# EAGLE board CTT-20190123 (EAGLE 6.6.0), part 1 of 3
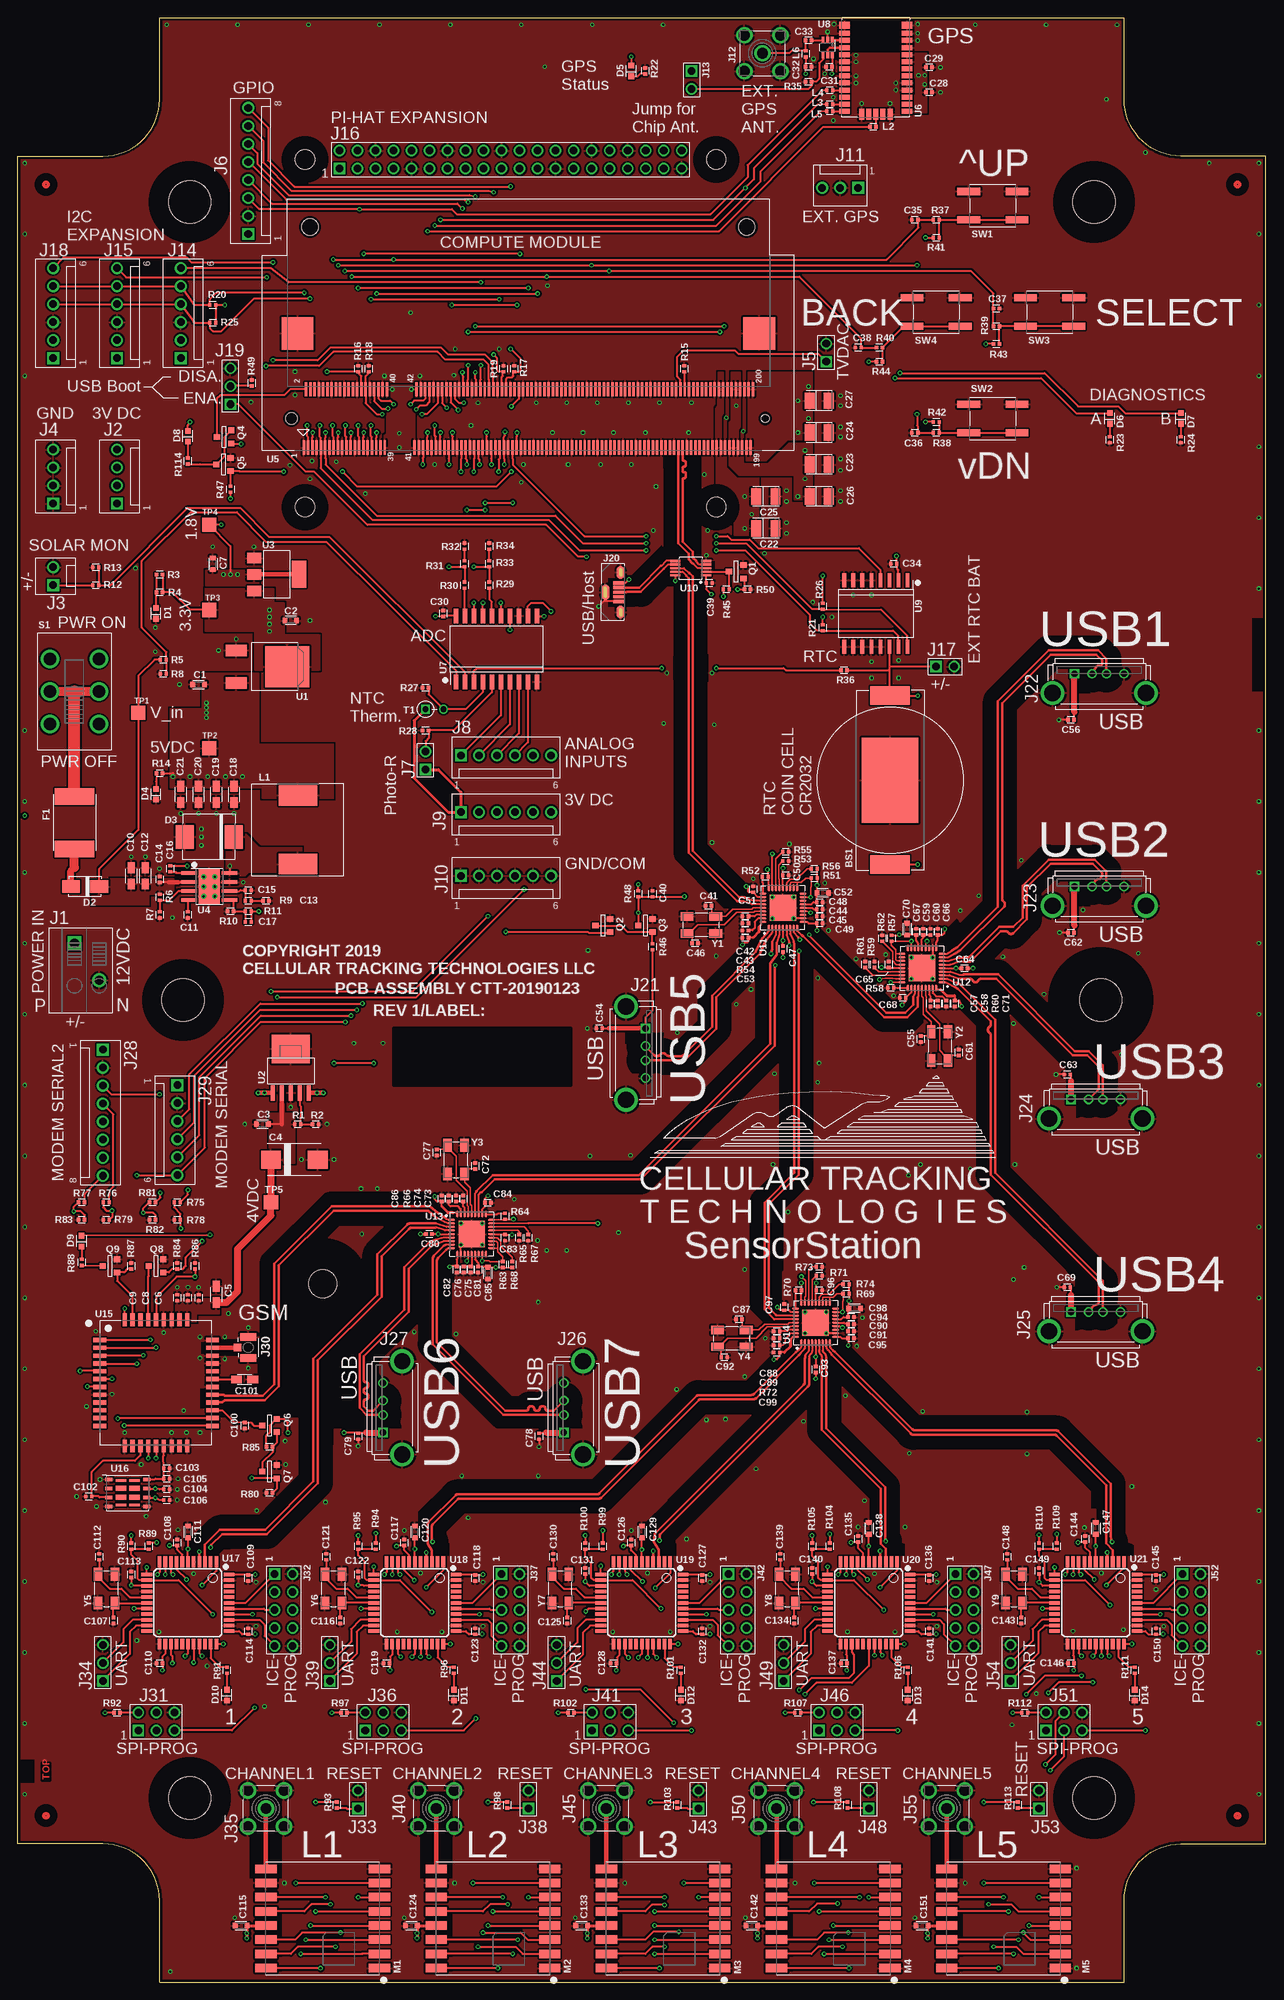
[diagram p12: board, top side]
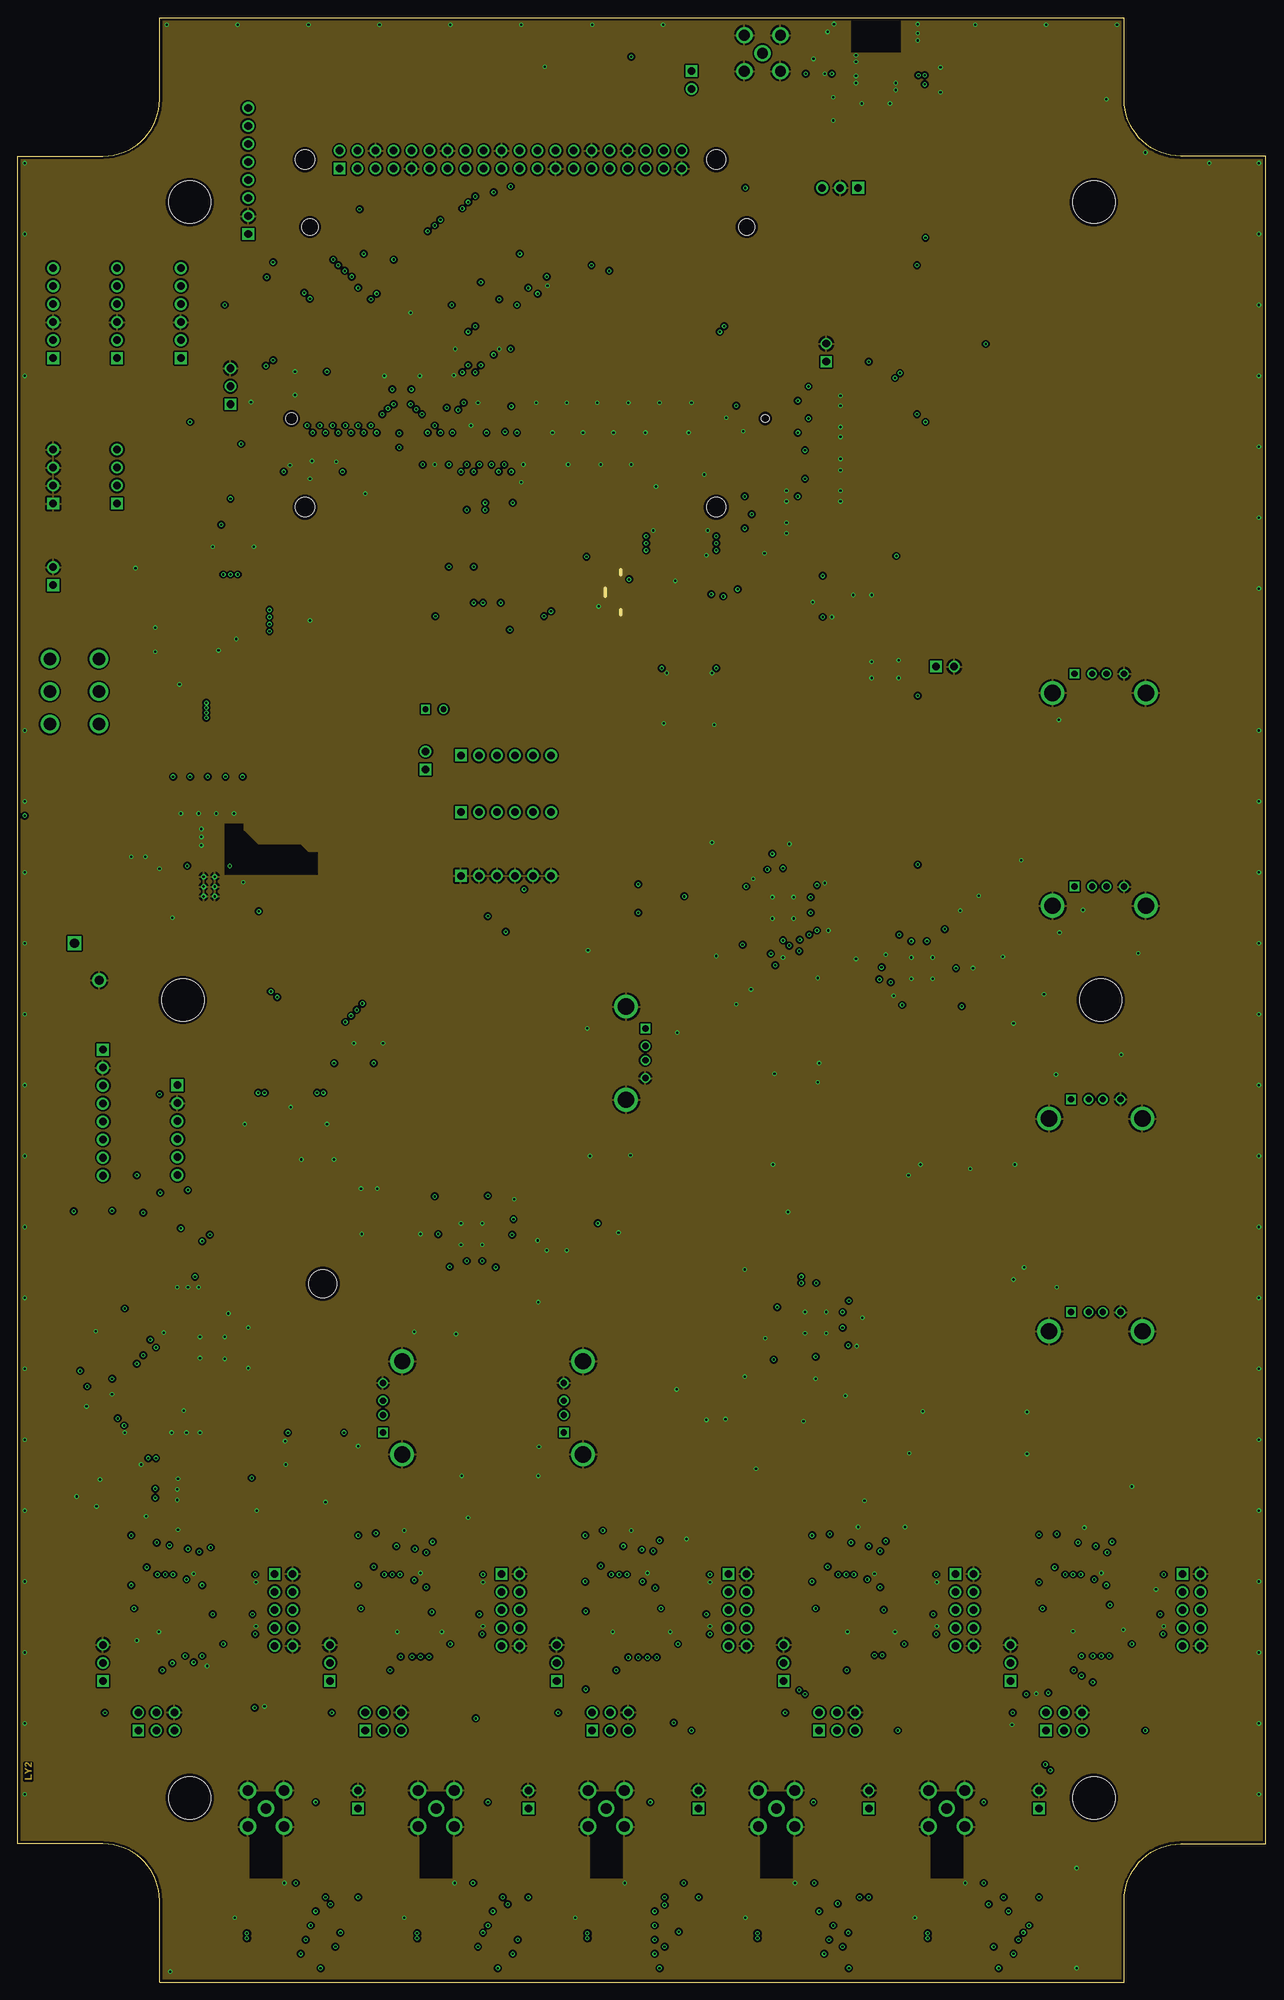
[diagram p13: board, inner layer Route2]
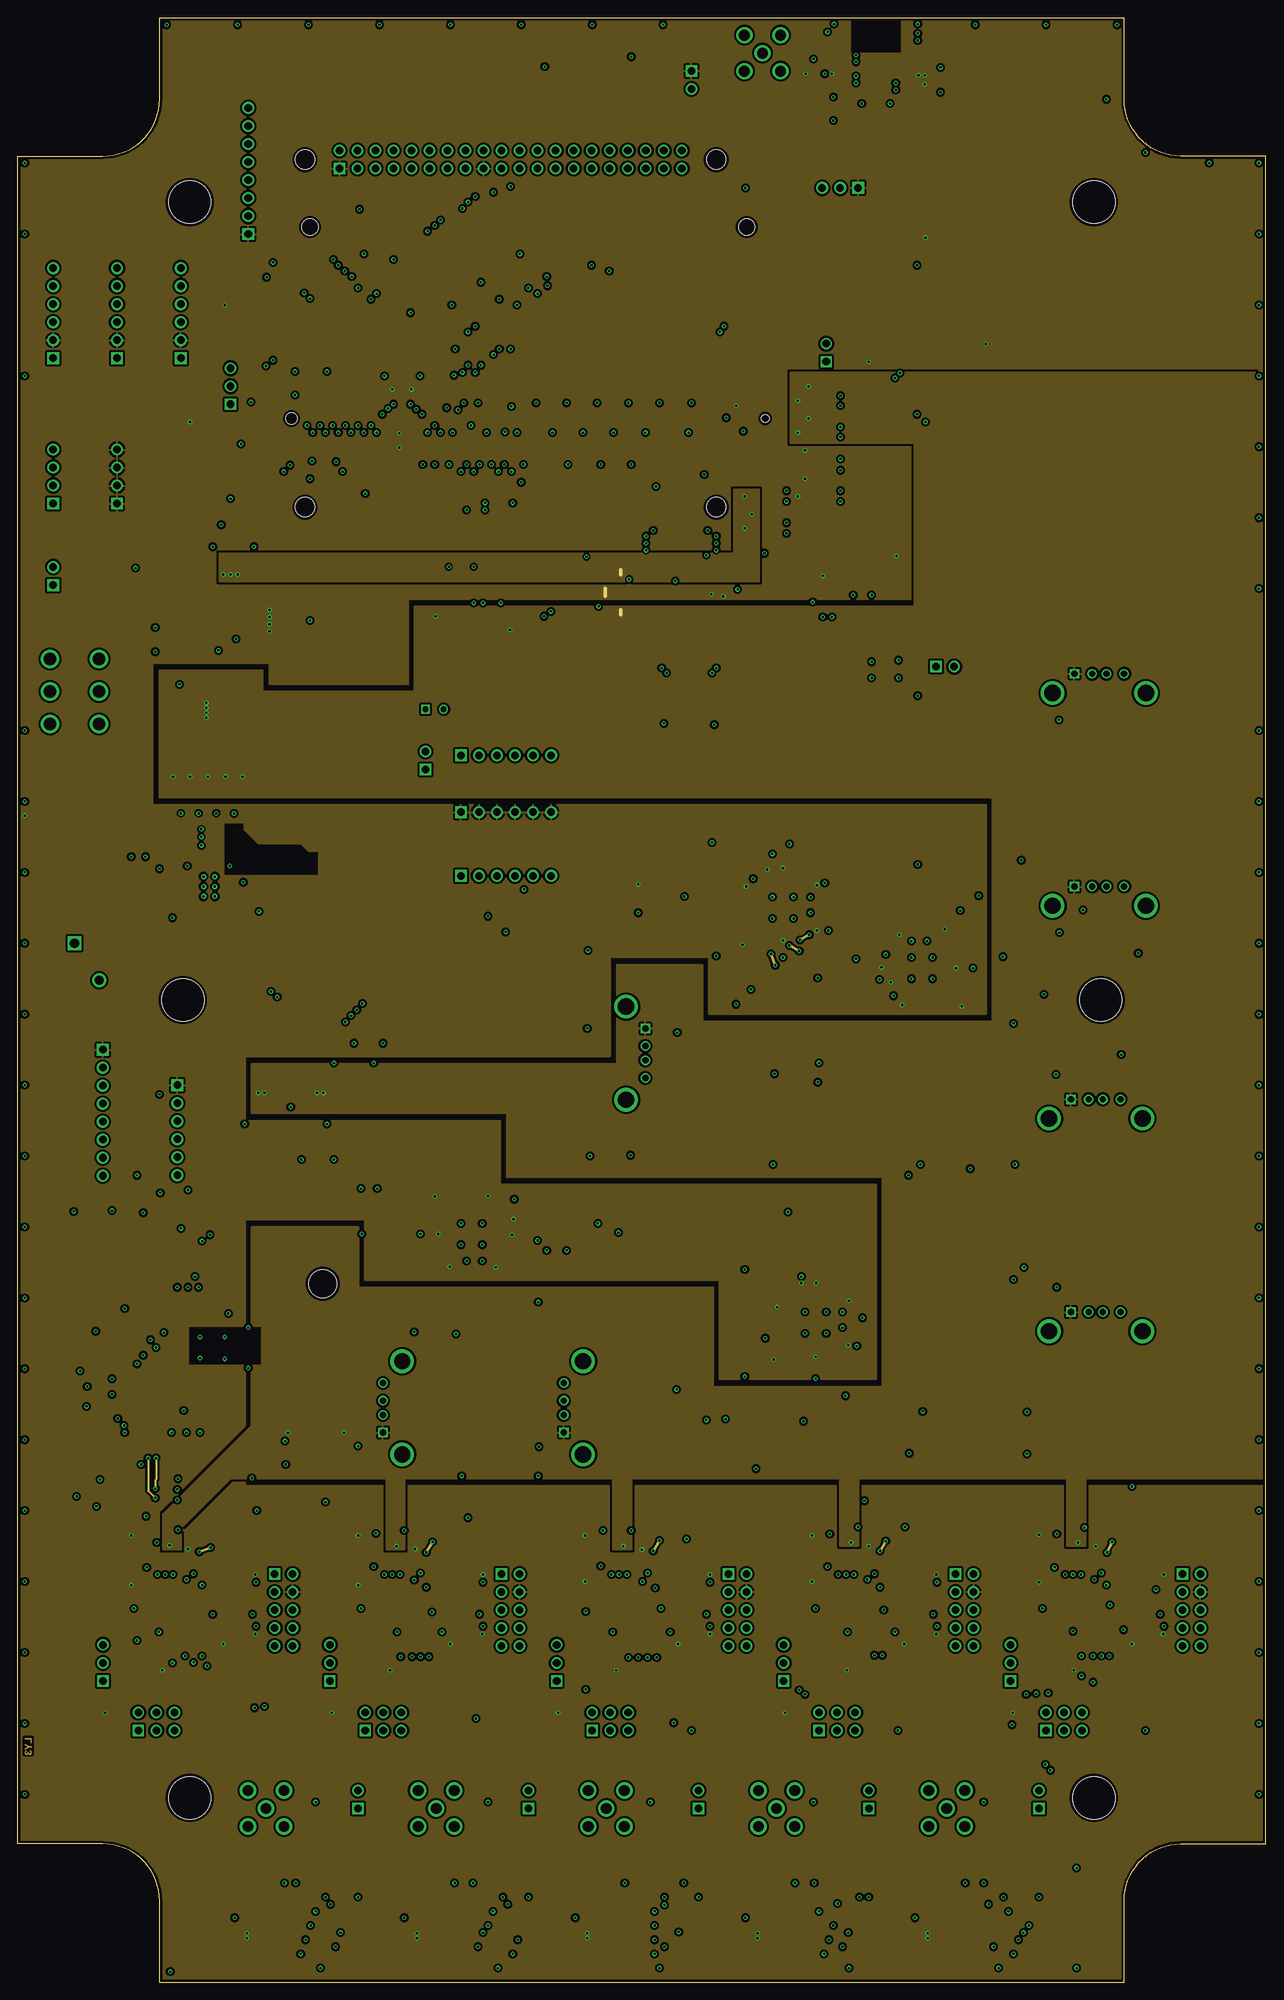
[diagram p14: board, inner layer Route3]
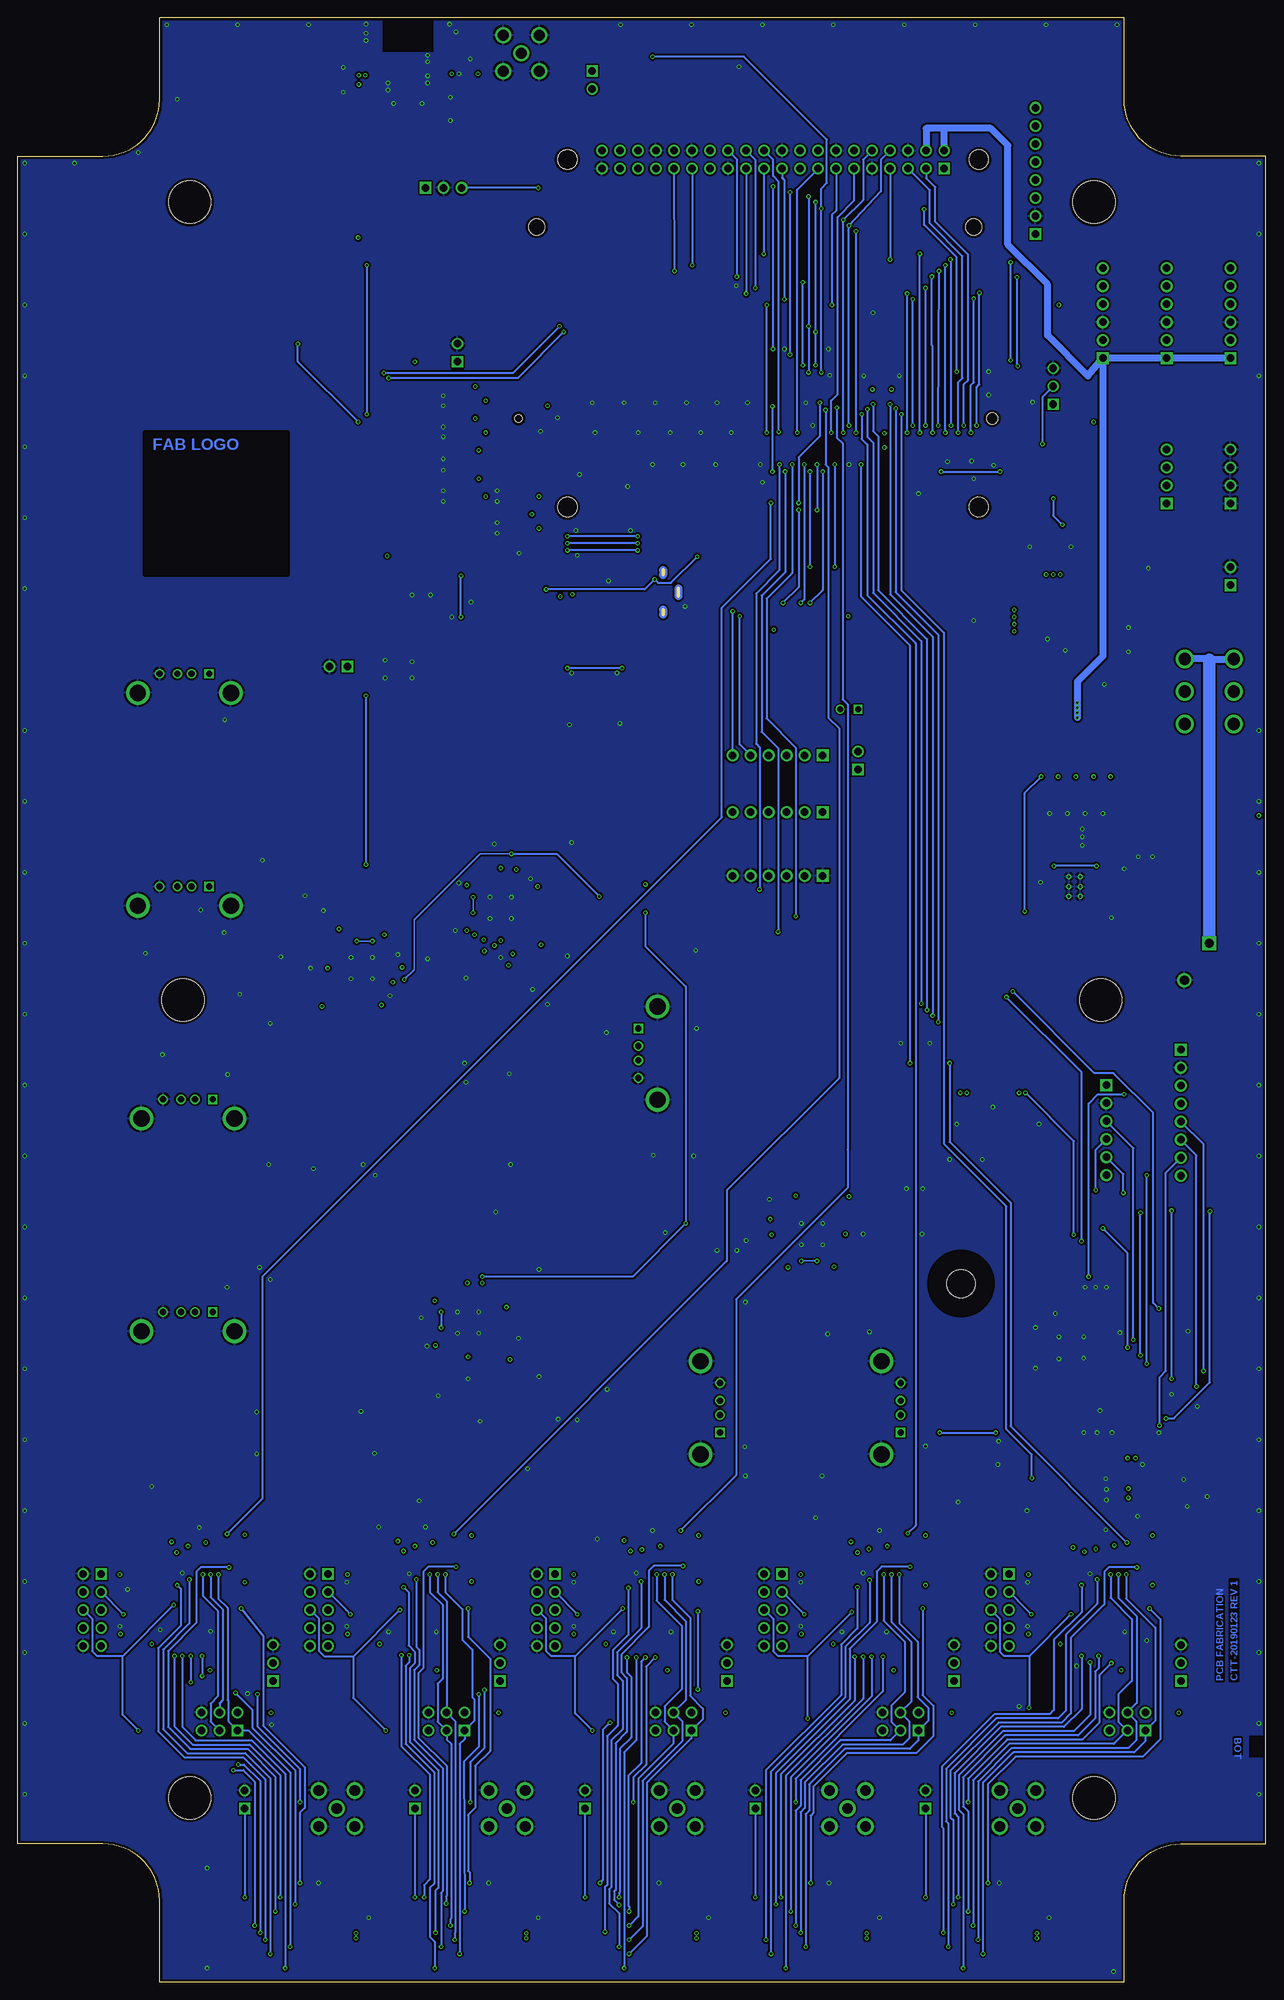
[diagram p15: board, bottom side, seen from below]

Size 176 x 277 mm. Coordinates in mm from the lower left corner, seen from the top.
Outline: 20,0 156,0 156,11.5 arc-90 164,19.5 176,19.5 176,257.5 164,257.5 arc-90 156,265.5 156,277 20,277 20,265.5 arc-90 12,257.5 0,257.5 0,19.5 12,19.5 arc-90 20,11.5 20,0
Copper layers (1*2+3*16): Top 0.035mm / dielectric 0.15mm / Route2 0.035mm / dielectric 1mm / Route3 0.035mm / dielectric 0.15mm / Bottom 0.035mm
Design rules "CTT_BaseStation": minimum track width 0.15mm, minimum drill 12mil, track to track 0.15mm, track to pad 0.15mm, pad to pad 0.15mm, via to via 0.2mm, smd to smd 0.15mm, copper to edge 15mil, drill to drill 8mil, minimum pad ring 8mil, minimum via ring 6mil, stop-mask expansion 2mil, vias tented up to drill 0mil, thermal gap 12mil
Net classes: 1 USB: width 0.381 mm, drill 0.305 mm, clearance 0.229 mm
Holes 6 mm at 152.7,138.5 23.3,138.5 24.25,251 151.75,251 151.75,26 24.25,26
Holes 4 mm at 43,98.5
tRestrict: area 147.2,133 to 158.2,144; area 17.8,133 to 28.8,144; area 146.2,245.5 to 157.2,256.5; area 146.2,20.5 to 157.2,31.5; area 18.8,245.5 to 29.8,256.5; area 18.8,20.5 to 29.8,31.5; area 53,126.5 to 78,134.5; area 38.5,94 to 47.5,103
bRestrict: area 38.5,94 to 47.5,103; 4 lines

## Footprints (pad centres in the part's own frame; a part is rotated, then mirrored left to right if it is on the bottom)
BC-2003-TR = smd 2.6 x 5.56: P1 -11.905,0; P2 11.905,0 | smd 12 x 8: P3 0,0
C0603_IPC7351_MED = smd 0.65 x 0.8: P$1 -0.825,0; P$2 0.825,0
C7343 = smd 2.794 x 2.54: + -3.302,0; - 3.302,0
C0805 = smd 1.524 x 1.016: 1 -1.143,0; 2 1.143,0
C0402_IPC7351_MED = smd 0.45 x 0.55: P$1 -0.425,0; P$2 0.425,0
CAP1411-AVX_F97SERIES = smd 1.4 x 2.3: + 1.35,0; - -1.35,0
LED0603 = smd 0.8 x 0.8: A 0.75,0; K -0.75,0
SMA = smd 2.5 x 1.7: A 2,0; C -2,0
SMC = smd 2.5 x 3.3: A 3.45,0; K -3.45,0
SMD2920_0ZCF-SERIES = smd 2.3 x 5.6: P$1 -3.7,0; P$2 3.7,0
1-2834011-2 = drill 1.3 square: 1 0,0 | drill 1.3: 2 3.5,-5.2
MTA100-4 = drill 1.067 pad 1.676 square: 1 0,0 | drill 1.067 pad 1.676: 2 2.54,0; 3 5.08,0; 4 7.62,0
MTA100-2 = drill 1.067 pad 1.676 square: 1 0,0 | drill 1.067 pad 1.676: 2 2.54,0
CON2X1 = drill 1.067 square: 1 0,0 | drill 1.067: 2 2.54,0
MTA100-8 = drill 1.067 pad 1.676 square: 1 0,0 | drill 1.067 pad 1.676: 2 2.54,0; 3 5.08,0; 4 7.62,0; 5 10.16,0; 6 12.7,0; 7 15.24,0; 8 17.78,0
MTA100-6 = drill 1.067 pad 1.676 square: 1 0,0 | drill 1.067 pad 1.676: 2 2.54,0; 3 5.08,0; 4 7.62,0; 5 10.16,0; 6 12.7,0
MTA100-3 = drill 1.067 pad 1.676 square: 1 0,0 | drill 1.067 pad 1.676: 2 2.54,0; 3 5.08,0
CON_SMA_TH_VERT = drill 1.524 pad 2.032: C 0,0 | drill 1.524 pad 2.184: P$1 -2.54,2.54; P$2 2.54,2.54; P$3 2.54,-2.54; P$4 -2.54,-2.54
CON20X2 = drill 1.067 square: 1 -24.13,-1.27 | drill 1.067: 2 -24.13,1.27; 3 -21.59,-1.27; 4 -21.59,1.27; 5 -19.05,-1.27; 6 -19.05,1.27; 7 -16.51,-1.27; 8 -16.51,1.27; 9 -13.97,-1.27; 10 -13.97,1.27; 11 -11.43,-1.27; 12 -11.43,1.27; 13 -8.89,-1.27; 14 -8.89,1.27; 15 -6.35,-1.27; 16 -6.35,1.27; 17 -3.81,-1.27; 18 -3.81,1.27; 19 -1.27,-1.27; 20 -1.27,1.27; 21 1.27,-1.27; 22 1.27,1.27; 23 3.81,-1.27; 24 3.81,1.27; 25 6.35,-1.27; 26 6.35,1.27; 27 8.89,-1.27; 28 8.89,1.27; 29 11.43,-1.27; 30 11.43,1.27; 31 13.97,-1.27; 32 13.97,1.27; 33 16.51,-1.27; 34 16.51,1.27; 35 19.05,-1.27; 36 19.05,1.27; 37 21.59,-1.27; 38 21.59,1.27; 39 24.13,-1.27; 40 24.13,1.27
CON3X1 = drill 1.067 square: 1 0,0 | drill 1.067: 2 2.54,0; 3 5.08,0
MOLEX_105133-0011 = smd 0.45 x 1.5: 1 -1.3,-0.25; 2 -0.65,-0.25; 3 0,-0.25; 4 0.65,-0.25; 5 1.3,-0.25 | smd 1.8 x 1.1: P$1 2.8,0; P$2 -2.8,0 | smd 2.2 x 1.1: P$3 0,-2.15
UE27AE54100 = drill 0.889 square: 1 -3.5,0 | drill 0.889: 2 -1,0; 3 1,0; 4 3.5,0 | drill 2.311: P$1 -6.57,-2.71; P$2 6.57,-2.71
U.FL-R-SMT-1 = smd 1.05 x 2.2: GND -1.475,0; GND@1 1.475,0 | smd 1 x 1.05: SIG 0,-1.525
CON3X2 = drill 1.067 square: 1 0,0 | drill 1.067: 2 0,2.54; 3 2.54,0; 4 2.54,2.54; 5 5.08,0; 6 5.08,2.54
CON_5X2 = drill 1.067 square: 1 -5.08,-1.27 | drill 1.067: 2 -5.08,1.27; 3 -2.54,-1.27; 4 -2.54,1.27; 5 0,-1.27; 6 0,1.27; 7 2.54,-1.27; 8 2.54,1.27; 9 5.08,-1.27; 10 5.08,1.27
SRR1260 = smd 2.9 x 5.4: 2 4.85,0; P$1 -4.85,0
L0402_IPC7351_MED = smd 0.45 x 0.55: P$1 -0.425,0; P$2 0.425,0
RFM95W = smd 3 x 1.2: 1 -8,7; 2 -8,5; 3 -8,3; 4 -8,1; 5 -8,-1; 6 -8,-3; 7 -8,-5; 8 -8,-7; 9 8,-7; 10 8,-5; 11 8,-3; 12 8,-1; 13 8,1; 14 8,3; 15 8,5; 16 8,7
SOT-23 = smd 0.787 x 0.889: 1 0.94,1.016; 2 -0.94,1.016; 3 0,-1.016
R0402_IPC7351_MED = smd 0.45 x 0.55: P$1 -0.425,0; P$2 0.425,0
CW_GF-126-0159 = drill 1.727 pad 2.286: 1C -3.454,0; 1D -3.454,-4.597; 1U -3.454,4.597; 2C 3.454,0; 2D 3.454,-4.597; 2U 3.454,4.597
EVQP0 = smd 3.2 x 1: A -3.4,2; A@1 3.4,2; B -3.4,-2; B@1 3.4,-2
DO35-VERT = drill 0.813 square: P$1 0,0 | drill 0.813: P$2 2.54,0
SMD_PAD = smd 2 x 2: 1 0,0
DPAK = smd 3 x 1.6: 1 7.18,-2.285; 3 7.18,2.285 | smd 6.2 x 5.8: 4 0,0
TI_R-PDSO-G6 = smd 0.6 x 2.2: 1 -2.54,-3.1; 2 -1.27,-3.1; 3 0,-3.1; 4 1.27,-3.1; 5 2.54,-3.1 | smd 5.3 x 4: TAB 0,3.1
SOT-223 = smd 1.499 x 2.007: 1 -2.311,-3.15; 2 0,-3.15; 3 2.311,-3.15 | smd 3.81 x 2.007: 4 0,3.15
TI_R-PDSO-G8 = smd 0.5 x 2.2: 1 -1.905,-2.875; 2 -0.635,-2.875; 3 0.635,-2.875; 4 1.905,-2.875; 5 1.905,2.875; 6 0.635,2.875; 7 -0.635,2.875; 8 -1.905,2.875 | drill 0.305: P$1 0,0.8; P$2 -1.4,0.8; P$3 -1.4,-0.8; P$4 0,-0.8; P$5 1.4,-0.8; P$6 1.4,0.8 | smd 4.9 x 2.95: PAD 0,0
1473149-4 = smd 2 x 0.35: 1 -4.1,31.65; 2 4.1,31.35; 3 -4.1,31.05; 4 4.1,30.75; 5 -4.1,30.45; 6 4.1,30.15; 7 -4.1,29.85; 8 4.1,29.55; 9 -4.1,29.25; 10 4.1,28.95; 11 -4.1,28.65; 12 4.1,28.35; 13 -4.1,28.05; 14 4.1,27.75; 15 -4.1,27.45; 16 4.1,27.15; 17 -4.1,26.85; 18 4.1,26.55; 19 -4.1,26.25; 20 4.1,25.95; 21 -4.1,25.65; 22 4.1,25.35; 23 -4.1,25.05; 24 4.1,24.75; 25 -4.1,24.45; 26 4.1,24.15; 27 -4.1,23.85; 28 4.1,23.55; 29 -4.1,23.25; 30 4.1,22.95; 31 -4.1,22.65; 32 4.1,22.35; 33 -4.1,22.05; 34 4.1,21.75; 35 -4.1,21.45; 36 4.1,21.15; 37 -4.1,20.85; 38 4.1,20.55; 39 -4.1,20.25; 40 4.1,19.95; 41 -4.1,16.05; 42 4.1,15.75; 43 -4.1,15.45; 44 4.1,15.15; 45 -4.1,14.85; 46 4.1,14.55; 47 -4.1,14.25; 48 4.1,13.95; 49 -4.1,13.65; 50 4.1,13.35; 51 -4.1,13.05; 52 4.1,12.75; 53 -4.1,12.45; 54 4.1,12.15; 55 -4.1,11.85; 56 4.1,11.55; 57 -4.1,11.25; 58 4.1,10.95; 59 -4.1,10.65; 60 4.1,10.35; 61 -4.1,10.05; 62 4.1,9.75; 63 -4.1,9.45; 64 4.1,9.15; 65 -4.1,8.85; 66 4.1,8.55; 67 -4.1,8.25; 68 4.1,7.95; 69 -4.1,7.65; 70 4.1,7.35; 71 -4.1,7.05; 72 4.1,6.75; 73 -4.1,6.45; 74 4.1,6.15; 75 -4.1,5.85; 76 4.1,5.55; 77 -4.1,5.25; 78 4.1,4.95; 79 -4.1,4.65; 80 4.1,4.35; 81 -4.1,4.05; 82 4.1,3.75; 83 -4.1,3.45; 84 4.1,3.15; 85 -4.1,2.85; 86 4.1,2.55; 87 -4.1,2.25; 88 4.1,1.95; 89 -4.1,1.65; 90 4.1,1.35; 91 -4.1,1.05; 92 4.1,0.75; 93 -4.1,0.45; 94 4.1,0.15; 95 -4.1,-0.15; 96 4.1,-0.45; 97 -4.1,-0.75; 98 4.1,-1.05; 99 -4.1,-1.35; 100 4.1,-1.65; 101 -4.1,-1.95; 102 4.1,-2.25; 103 -4.1,-2.55; 104 4.1,-2.85; 105 -4.1,-3.15; 106 4.1,-3.45; 107 -4.1,-3.75; 108 4.1,-4.05; 109 -4.1,-4.35; 110 4.1,-4.65; 111 -4.1,-4.95; 112 4.1,-5.25; 113 -4.1,-5.55; 114 4.1,-5.85; 115 -4.1,-6.15; 116 4.1,-6.45; 117 -4.1,-6.75; 118 4.1,-7.05; 119 -4.1,-7.35; 120 4.1,-7.65; 121 -4.1,-7.95; 122 4.1,-8.25; 123 -4.1,-8.55; 124 4.1,-8.85; 125 -4.1,-9.15; 126 4.1,-9.45; 127 -4.1,-9.75; 128 4.1,-10.05; 129 -4.1,-10.35; 130 4.1,-10.65; 131 -4.1,-10.95; 132 4.1,-11.25; 133 -4.1,-11.55; 134 4.1,-11.85; 135 -4.1,-12.15; 136 4.1,-12.45; 137 -4.1,-12.75; 138 4.1,-13.05; 139 -4.1,-13.35; 140 4.1,-13.65; 141 -4.1,-13.95; 142 4.1,-14.25; 143 -4.1,-14.55; 144 4.1,-14.85; 145 -4.1,-15.15; 146 4.1,-15.45; 147 -4.1,-15.75; 148 4.1,-16.05; 149 -4.1,-16.35; 150 4.1,-16.65; 151 -4.1,-16.95; 152 4.1,-17.25; 153 -4.1,-17.55; 154 4.1,-17.85; 155 -4.1,-18.15; 156 4.1,-18.45; 157 -4.1,-18.75; 158 4.1,-19.05; 159 -4.1,-19.35; 160 4.1,-19.65; 161 -4.1,-19.95; 162 4.1,-20.25; 163 -4.1,-20.55; 164 4.1,-20.85; 165 -4.1,-21.15; 166 4.1,-21.45; 167 -4.1,-21.75; 168 4.1,-22.05; 169 -4.1,-22.35; 170 4.1,-22.65; 171 -4.1,-22.95; 172 4.1,-23.25; 173 -4.1,-23.55; 174 4.1,-23.85; 175 -4.1,-24.15; 176 4.1,-24.45; 177 -4.1,-24.75; 178 4.1,-25.05; 179 -4.1,-25.35; 180 4.1,-25.65; 181 -4.1,-25.95; 182 4.1,-26.25; 183 -4.1,-26.55; 184 4.1,-26.85; 185 -4.1,-27.15; 186 4.1,-27.45; 187 -4.1,-27.75; 188 4.1,-28.05; 189 -4.1,-28.35; 190 4.1,-28.65; 191 -4.1,-28.95; 192 4.1,-29.25; 193 -4.1,-29.55; 194 4.1,-29.85; 195 -4.1,-30.15; 196 4.1,-30.45; 197 -4.1,-30.75; 198 4.1,-31.05; 199 -4.1,-31.35; 200 4.1,-31.65 | smd 4.6 x 4.5: P$1 12,32.55; P$2 12,-32.55 | hole 1.6: 0,33.4 | hole 1.1: 0,-33.4 | hole 2.311: 27,30.8; 27,-30.8
LCC31 = smd 0.7 x 1.5: 1 -6.2,-4.4; 2 -5.2,-4.4; 3 -4.2,-4.4; 4 -3.2,-4.4; 5 -2.2,-4.4; 6 -1.2,-4.4; 7 -0.2,-4.4; 8 0.8,-4.4; 9 1.8,-4.4; 10 2.8,-4.4; 11 3.8,-4.4; 12 4.8,-4.4; 15 4.8,4.4; 16 3.8,4.4; 17 2.8,4.4; 18 1.8,4.4; 19 0.8,4.4; 20 -0.2,4.4; 21 -1.2,4.4; 22 -2.2,4.4; 23 -3.2,4.4; 24 -4.2,4.4; 25 -5.2,4.4; 26 -6.2,4.4 | smd 1 x 1.5: 13 5.95,-4.4; 14 5.95,4.4 | smd 1.5 x 0.7: 27 -6.6,2; 28 -6.6,1; 29 -6.6,0; 30 -6.6,-1; 31 -6.6,-2
SOIC20_DW0020A = smd 0.6 x 2: 1 -5.715,-4.65; 2 -4.445,-4.65; 3 -3.175,-4.65; 4 -1.905,-4.65; 5 -0.635,-4.65; 6 0.635,-4.65; 7 1.905,-4.65; 8 3.175,-4.65; 9 4.445,-4.65; 10 5.715,-4.65; 11 5.715,4.65; 12 4.445,4.65; 13 3.175,4.65; 14 1.905,4.65; 15 0.635,4.65; 16 -0.635,4.65; 17 -1.905,4.65; 18 -3.175,4.65; 19 -4.445,4.65; 20 -5.715,4.65
SC-70_PEREGRINE = smd 0.4 x 0.9: 1 -0.65,-1.05; 2 0,-1.05; 3 0.65,-1.05; 4 0.65,1.05; 5 0,1.05; 6 -0.65,1.05
SO16-WIDE_MAXIM = smd 0.53 x 1.98: 1 -4.445,-4.685; 2 -3.175,-4.685; 3 -1.905,-4.685; 4 -0.635,-4.685; 5 0.635,-4.685; 6 1.905,-4.685; 7 3.175,-4.685; 8 4.445,-4.685; 9 4.445,4.685; 10 3.175,4.685; 11 1.905,4.685; 12 0.635,4.685; 13 -0.635,4.685; 14 -1.905,4.685; 15 -3.175,4.685; 16 -4.445,4.685
MSOP-10 = smd 0.3 x 1.4: 1 -1,-2.2; 2 -0.5,-2.2; 3 0,-2.2; 4 0.5,-2.2; 5 1,-2.2; 6 1,2.2; 7 0.5,2.2; 8 0,2.2; 9 -0.5,2.2; 10 -1,2.2
SQFN-36 = smd 1 x 0.28: 1 -2.825,2; 2 -2.825,1.5; 3 -2.825,1; 4 -2.825,0.5; 5 -2.825,0; 6 -2.825,-0.5; 7 -2.825,-1; 8 -2.825,-1.5; 9 -2.825,-2; 19 2.825,-2; 20 2.825,-1.5; 21 2.825,-1; 22 2.825,-0.5; 23 2.825,0; 24 2.825,0.5; 25 2.825,1; 26 2.825,1.5; 27 2.825,2 | smd 0.28 x 1: 10 -2,-2.825; 11 -1.5,-2.825; 12 -1,-2.825; 13 -0.5,-2.825; 14 0,-2.825; 15 0.5,-2.825; 16 1,-2.825; 17 1.5,-2.825; 18 2,-2.825; 28 2,2.825; 29 1.5,2.825; 30 1,2.825; 31 0.5,2.825; 32 0,2.825; 33 -0.5,2.825; 34 -1,2.825; 35 -1.5,2.825; 36 -2,2.825 | smd 3.7 x 3.7: C 0,0
SIM800C = smd 1.8 x 0.6: 1 -7.95,6.05; 2 -7.95,4.95; 3 -7.95,3.85; 4 -7.95,2.75; 5 -7.95,1.65; 6 -7.95,0.55; 7 -7.95,-0.55; 8 -7.95,-1.65; 9 -7.95,-2.75; 10 -7.95,-3.85; 11 -7.95,-4.95; 12 -7.95,-6.05; 22 7.95,-6.05; 23 7.95,-4.95; 24 7.95,-3.85; 25 7.95,-2.75; 26 7.95,-1.65; 27 7.95,-0.55; 28 7.95,0.55; 29 7.95,1.65; 30 7.95,2.75; 31 7.95,3.85; 32 7.95,4.95; 33 7.95,6.05 | smd 0.6 x 1.8: 13 -4.4,-8.9; 14 -3.3,-8.9; 15 -2.2,-8.9; 16 -1.1,-8.9; 17 0,-8.9; 18 1.1,-8.9; 19 2.2,-8.9; 20 3.3,-8.9; 21 4.4,-8.9; 34 4.4,8.9; 35 3.3,8.9; 36 2.2,8.9; 37 1.1,8.9; 38 0,8.9; 39 -1.1,8.9; 40 -2.2,8.9; 41 -3.3,8.9; 42 -4.4,8.9
MFF2 = smd 0.96 x 0.5: 1 -2.675,1.905; 2 -2.675,0.635; 3 -2.675,-0.635; 4 -2.675,-1.905; 5 2.675,-1.905; 6 2.675,-0.635; 7 2.675,0.635; 8 2.675,1.905 | smd 1.5 x 0.35: P$1 -0.95,1.73; P$4 -0.95,-1.73; P$5 0.95,-1.73; P$8 0.95,1.73 | smd 1.5 x 0.7: P$2 -0.95,0.635; P$3 -0.95,-0.635; P$6 0.95,-0.635; P$7 0.95,0.635
TQFP44 = smd 1.5 x 0.5: 1 -5.8,4; 2 -5.8,3.2; 3 -5.8,2.4; 4 -5.8,1.6; 5 -5.8,0.8; 6 -5.8,0; 7 -5.8,-0.8; 8 -5.8,-1.6; 9 -5.8,-2.4; 10 -5.8,-3.2; 11 -5.8,-4; 23 5.8,-4; 24 5.8,-3.2; 25 5.8,-2.4; 26 5.8,-1.6; 27 5.8,-0.8; 28 5.8,0; 29 5.8,0.8; 30 5.8,1.6; 31 5.8,2.4; 32 5.8,3.2; 33 5.8,4 | smd 0.5 x 1.5: 12 -4,-5.8; 13 -3.2,-5.8; 14 -2.4,-5.8; 15 -1.6,-5.8; 16 -0.8,-5.8; 17 0,-5.8; 18 0.8,-5.8; 19 1.6,-5.8; 20 2.4,-5.8; 21 3.2,-5.8; 22 4,-5.8; 34 4,5.8; 35 3.2,5.8; 36 2.4,5.8; 37 1.6,5.8; 38 0.8,5.8; 39 0,5.8; 40 -0.8,5.8; 41 -1.6,5.8; 42 -2.4,5.8; 43 -3.2,5.8; 44 -4,5.8
PI_HAT_OUTLINE = hole 2.75: -29,0; 29,0; 29,-49; -29,-49
ABM3B = smd 1.803 x 1.194: 1 -2.032,-1.194; 2 2.032,-1.194; 3 2.032,1.194; 4 -2.032,1.194

## Placement (x,y rotation side)
BS1  BC-2003  [BC-2003-TR]  123,169.5 90 top
C1  1u  [C0603_IPC7351_MED]  25.5,183 0 top
C2  1u  [C0603_IPC7351_MED]  38.5,192 180 top
C3  1u  [C0603_IPC7351_MED]  34.5,121 0 top
C4  100u  [C7343]  39,116 0 top
C5  22u  [C0805]  28,97 270 top
C6  100n  [C0402_IPC7351_MED]  25.5,96.5 270 top
C7  1u  [C0603_IPC7351_MED]  27.5,200 270 top
C8  33p  [C0402_IPC7351_MED]  24,96.5 270 top
C9  10p  [C0402_IPC7351_MED]  22.5,96.5 270 top
C10  10u  [C0805]  16,156 270 top
C11  10n  [C0402_IPC7351_MED]  24,150.5 90 top
C12  10u  [C0805]  18,156 270 top
C13  2.2n  [C0402_IPC7351_MED]  35,152.5 180 top
C14  100n  [C0402_IPC7351_MED]  20,155.5 270 top
C15  33p  [C0402_IPC7351_MED]  32.5,154 180 top
C16  100n  [C0402_IPC7351_MED]  21.5,157 90 top
C17  10n  [C0402_IPC7351_MED]  32.5,149.5 0 top
C18  22u  [C0805]  30.5,167.5 90 top
C19  22u  [C0805]  28,167.5 90 top
C20  22u  [C0805]  25.5,167.5 90 top
C21  22u  [C0805]  23,167.5 90 top
C22  10u Ta  [CAP1411-AVX_F97SERIES]  105.5,205 180 top
C23  10u Ta  [CAP1411-AVX_F97SERIES]  113,214 180 top
C24  10u Ta  [CAP1411-AVX_F97SERIES]  113,218.5 180 top
C25  10u Ta  [CAP1411-AVX_F97SERIES]  105.5,209.5 180 top
C26  10u Ta  [CAP1411-AVX_F97SERIES]  113,209.5 180 top
C27  10u Ta  [CAP1411-AVX_F97SERIES]  113,223 180 top
C28  100n  [C0402_IPC7351_MED]  128.5,266.5 180 top
C29  1n  [C0402_IPC7351_MED]  128.5,270 180 top
C30  100n  [C0402_IPC7351_MED]  60,193 270 top
C31  100n  [C0402_IPC7351_MED]  114.4,270.1 180 top
C32  1n  [C0402_IPC7351_MED]  111.5,270.1 180 top
C33  100p  [C0402_IPC7351_MED]  111.5,273.8 180 top
C34  100n  [C0402_IPC7351_MED]  123.5,200 180 top
C35  1n  [C0402_IPC7351_MED]  126.5,248.5 0 top
C36  1n  [C0402_IPC7351_MED]  126.5,218.5 0 top
C37  1n  [C0402_IPC7351_MED]  138,236 180 top
C38  1n  [C0402_IPC7351_MED]  118.5,230.5 0 top
C39  100n  [C0402_IPC7351_MED]  97.5,197.3 0 top
C40  100p  [C0402_IPC7351_MED]  89.5,153.5 270 top
C41  15p  [C0402_IPC7351_MED]  97.4,151.8 0 top
C42  10n  [C0402_IPC7351_MED]  102.6,150.3 0 top
C43  100n  [C0402_IPC7351_MED]  102.6,149.3 0 top
C44  10n  [C0402_IPC7351_MED]  113.1,151.3 180 top
C45  100n  [C0402_IPC7351_MED]  113.1,150.3 180 top
C46  15p  [C0402_IPC7351_MED]  95.5,146.5 0 top
C47  100n  [C0402_IPC7351_MED]  107.9,145.7 90 top
C48  100n  [C0402_IPC7351_MED]  113.1,152.3 180 top
C49  100n  [C0402_IPC7351_MED]  113.1,149.3 180 top
C50  100n  [C0402_IPC7351_MED]  108.3,156.1 180 top
C51  100n  [C0402_IPC7351_MED]  103.7,154.1 270 top
C52  1u  [C0603_IPC7351_MED]  113.5,153.6 180 top
C53  100n  [C0402_IPC7351_MED]  102.6,147.3 0 top
C54  100n  [C0402_IPC7351_MED]  82,134.5 180 top
C55  15p  [C0402_IPC7351_MED]  127.3,133 90 top
C56  100n  [C0402_IPC7351_MED]  148.5,178 180 top
C57  10n  [C0402_IPC7351_MED]  128.7,138 90 top
C58  100n  [C0402_IPC7351_MED]  129.7,138 90 top
C59  10n  [C0402_IPC7351_MED]  127.7,148.1 270 top
C60  100n  [C0402_IPC7351_MED]  128.7,148.1 270 top
C61  15p  [C0402_IPC7351_MED]  132.7,131.1 90 top
C62  100n  [C0402_IPC7351_MED]  148.5,148 180 top
C63  100n  [C0402_IPC7351_MED]  148,128 180 top
C64  100n  [C0402_IPC7351_MED]  133.5,143 180 top
C65  100n  [C0402_IPC7351_MED]  122.8,143.5 270 top
C66  100n  [C0402_IPC7351_MED]  129.7,148.1 270 top
C67  100n  [C0402_IPC7351_MED]  126.7,148.1 270 top
C68  100n  [C0402_IPC7351_MED]  124.8,138.8 0 top
C69  100n  [C0402_IPC7351_MED]  148,98 180 top
C70  1u  [C0603_IPC7351_MED]  125.4,148.5 270 top
C71  100n  [C0402_IPC7351_MED]  132.1,138 90 top
C72  15p  [C0402_IPC7351_MED]  64.5,115.1 270 top
C73  10n  [C0402_IPC7351_MED]  62.8,110.5 270 top
C74  100n  [C0402_IPC7351_MED]  61.8,110.5 270 top
C75  10n  [C0402_IPC7351_MED]  63.9,100.5 90 top
C76  100n  [C0402_IPC7351_MED]  62.9,100.5 90 top
C77  15p  [C0402_IPC7351_MED]  59.1,117 270 top
C78  100n  [C0402_IPC7351_MED]  73.5,77 270 top
C79  100n  [C0402_IPC7351_MED]  48,77 270 top
C80  100n  [C0402_IPC7351_MED]  58,105.5 0 top
C81  100n  [C0402_IPC7351_MED]  64.9,100.5 90 top
C82  100n  [C0402_IPC7351_MED]  61.9,100.5 90 top
C83  100n  [C0402_IPC7351_MED]  68.7,105 90 top
C84  100n  [C0402_IPC7351_MED]  66.3,109.9 180 top
C85  1u  [C0603_IPC7351_MED]  66.3,100 90 top
C86  100n  [C0402_IPC7351_MED]  59.8,110.5 270 top
C87  15p  [C0402_IPC7351_MED]  101.7,93.5 0 top
C88  10n  [C0402_IPC7351_MED]  107,91.8 0 top
C89  100n  [C0402_IPC7351_MED]  107,90.8 0 top
C90  10n  [C0402_IPC7351_MED]  117.5,92.8 180 top
C91  100n  [C0402_IPC7351_MED]  117.5,91.8 180 top
C92  15p  [C0402_IPC7351_MED]  99.6,88.1 0 top
C93  100n  [C0402_IPC7351_MED]  112.5,86.4 90 top
C94  100n  [C0402_IPC7351_MED]  117.5,93.8 180 top
C95  100n  [C0402_IPC7351_MED]  117.5,90.8 180 top
C96  100n  [C0402_IPC7351_MED]  113,97.6 180 top
C97  100n  [C0402_IPC7351_MED]  108.1,95.2 270 top
C98  1u  [C0603_IPC7351_MED]  118,95 180 top
C99  100n  [C0402_IPC7351_MED]  107,88.8 0 top
C100  100n  [C0402_IPC7351_MED]  32,78.5 90 top
C101  22u  [C0805]  32,85 180 top
C102  22p  [C0402_IPC7351_MED]  10,68.5 0 top
C103  22p  [C0402_IPC7351_MED]  21,72.5 0 top
C104  22p  [C0402_IPC7351_MED]  21,69.5 180 top
C105  100n  [C0402_IPC7351_MED]  21,71 0 top
C106  22p  [C0402_IPC7351_MED]  21,68 180 top
C107  15p  [C0402_IPC7351_MED]  13.5,51 90 top
C108  100n  [C0402_IPC7351_MED]  22.5,62 90 top
C109  100n  [C0402_IPC7351_MED]  32.5,57 90 top
C110  100n  [C0402_IPC7351_MED]  20,45 0 top
C111  1u  [C0603_IPC7351_MED]  24,63.5 270 top
C112  15p  [C0402_IPC7351_MED]  11.5,60 270 top
C113  100n  [C0402_IPC7351_MED]  16,57.5 90 top
C114  100n  [C0402_IPC7351_MED]  32.5,49.5 90 top
C115  1u  [C0603_IPC7351_MED]  31.5,8 0 top
C116  15p  [C0402_IPC7351_MED]  45.5,51 90 top
C117  100n  [C0402_IPC7351_MED]  54.5,62 90 top
C118  100n  [C0402_IPC7351_MED]  64.5,57 90 top
C119  100n  [C0402_IPC7351_MED]  52,45 0 top
C120  1u  [C0603_IPC7351_MED]  56,63.5 270 top
C121  15p  [C0402_IPC7351_MED]  43.5,60 270 top
C122  100n  [C0402_IPC7351_MED]  48,57.5 90 top
C123  100n  [C0402_IPC7351_MED]  64.5,49.5 90 top
C124  1u  [C0603_IPC7351_MED]  55.5,8 0 top
C125  15p  [C0402_IPC7351_MED]  77.5,51 90 top
C126  100n  [C0402_IPC7351_MED]  86.5,62 90 top
C127  100n  [C0402_IPC7351_MED]  96.5,57 90 top
C128  100n  [C0402_IPC7351_MED]  84,45 0 top
C129  1u  [C0603_IPC7351_MED]  88,63.5 270 top
C130  15p  [C0402_IPC7351_MED]  75.5,60 270 top
C131  100n  [C0402_IPC7351_MED]  80,58 90 top
C132  100n  [C0402_IPC7351_MED]  96.5,49.5 90 top
C133  1u  [C0603_IPC7351_MED]  79.5,8 0 top
C134  15p  [C0402_IPC7351_MED]  109.5,51 90 top
C135  100n  [C0402_IPC7351_MED]  118.5,62.5 90 top
C136  100n  [C0402_IPC7351_MED]  128.5,57 90 top
C137  100n  [C0402_IPC7351_MED]  116.5,45 0 top
C138  1u  [C0603_IPC7351_MED]  120,64 270 top
C139  15p  [C0402_IPC7351_MED]  107.5,60 270 top
C140  100n  [C0402_IPC7351_MED]  112,58 90 top
C141  100n  [C0402_IPC7351_MED]  128.5,49.5 90 top
C142  1u  [C0603_IPC7351_MED]  103.5,8 0 top
C143  15p  [C0402_IPC7351_MED]  141.5,51 90 top
C144  100n  [C0402_IPC7351_MED]  150.5,62.5 90 top
C145  100n  [C0402_IPC7351_MED]  160.5,57 90 top
C146  100n  [C0402_IPC7351_MED]  148.5,45 0 top
C147  1u  [C0603_IPC7351_MED]  152,64 270 top
C148  15p  [C0402_IPC7351_MED]  139.5,60 270 top
C149  100n  [C0402_IPC7351_MED]  144,58 90 top
C150  100n  [C0402_IPC7351_MED]  160.5,49.5 90 top
C151  1u  [C0603_IPC7351_MED]  127.5,8 0 top
D1  LTST-C190KGKT  [LED0603]  19.5,193 90 top
D2  B340A-13-F  [SMA]  9.5,154.5 180 top
D3  B540C  [SMC]  27,161.5 180 top
D4  LTST-C190KSKT  [LED0603]  19.5,167.5 90 top
D5  LTST-C190KGKT  [LED0603]  86.5,269.5 90 top
D6  LTST-C190KGKT  [LED0603]  154,220.5 90 top
D7  LTST-C190KRKT  [LED0603]  164,220.5 90 top
D8  LTST-C190KGKT  [LED0603]  24,218 90 top
D9  LTST-C190TBKT  [LED0603]  9,104.5 90 top
D10  LTST-C190KRKT  [LED0603]  29.5,40.5 90 top
D11  LTST-C190KRKT  [LED0603]  61.5,40.5 90 top
D12  LTST-C190KRKT  [LED0603]  93.5,40.5 90 top
D13  LTST-C190KRKT  [LED0603]  125.5,40.5 90 top
D14  LTST-C190KRKT  [LED0603]  157.5,40.5 90 top
F1  0ZCF0150FF2C  [SMD2920_0ZCF-SERIES]  8,163.5 270 top
J1  1-2834011-2  [1-2834011-2]  8,146.5 0 top
J2  22-23-2041  [MTA100-4]  14,208.5 90 top
J3  22-23-2021  [MTA100-2]  5,197 90 top
J4  22-23-2041  [MTA100-4]  5,208.5 90 top
J5  CON2X1  [CON2X1]  114,228.5 90 top
J6  22-23-2081  [MTA100-8]  32.5,246.5 90 top
J7  DNP  [CON2X1]  57.5,171 90 top
J8  22-23-2061  [MTA100-6]  62.5,173 0 top
J9  22-23-2061  [MTA100-6]  62.5,165 0 top
J10  22-23-2061  [MTA100-6]  62.5,156 0 top
J11  22-23-2031  [MTA100-3]  118.5,253 180 top
J12  5-1814832-1  [CON_SMA_TH_VERT]  105,272 0 top
J13  CON2X1  [CON2X1]  95,269.5 270 top
J14  22-23-2061  [MTA100-6]  23,229 90 top
J15  22-23-2061  [MTA100-6]  14,229 90 top
J16  CON20X2  [CON20X2]  69.5,257 0 top
J17  CON2X1  [CON2X1]  129.5,185.5 0 top
J18  22-23-2061  [MTA100-6]  5,229 90 top
J19  CON3X1  [CON3X1]  30,222.5 90 top
J20  MOLEX_105133-0011  [MOLEX_105133-0011]  85,196 270 top
J21  UE27AE54100  [UE27AE54100]  88.5,131 270 top
J22  UE27AE54100  [UE27AE54100]  152.5,184.5 0 top
J23  UE27AE54100  [UE27AE54100]  152.5,154.5 0 top
J24  UE27AE54100  [UE27AE54100]  152,124.5 0 top
J25  UE27AE54100  [UE27AE54100]  152,94.5 0 top
J26  UE27AE54100  [UE27AE54100]  77,81 90 top
J27  UE27AE54100  [UE27AE54100]  51.5,81 90 top
J28  22-23-2081  [MTA100-8]  12,131.5 270 top
J29  22-23-2061  [MTA100-6]  22.5,126.5 270 top
J30  U.FL-R-SMT-1  [U.FL-R-SMT-1]  32.5,89.5 270 top
J31  CON3X2  [CON3X2]  17,35.5 0 top
J32  CON_2X5  [CON_5X2]  37.5,52.5 270 top
J33  CON2X1  [CON2X1]  48,24.5 90 top
J34  CON3X1  [CON3X1]  12,42.5 90 top
J35  5-1814832-1  [CON_SMA_TH_VERT]  35,24.5 180 top
J36  CON3X2  [CON3X2]  49,35.5 0 top
J37  CON_2X5  [CON_5X2]  69.5,52.5 270 top
J38  CON2X1  [CON2X1]  72,24.5 90 top
J39  CON3X1  [CON3X1]  44,42.5 90 top
J40  5-1814832-1  [CON_SMA_TH_VERT]  59,24.5 180 top
J41  CON3X2  [CON3X2]  81,35.5 0 top
J42  CON_2X5  [CON_5X2]  101.5,52.5 270 top
J43  CON2X1  [CON2X1]  96,24.5 90 top
J44  CON3X1  [CON3X1]  76,42.5 90 top
J45  5-1814832-1  [CON_SMA_TH_VERT]  83,24.5 180 top
J46  CON3X2  [CON3X2]  113,35.5 0 top
J47  CON_2X5  [CON_5X2]  133.5,52.5 270 top
J48  CON2X1  [CON2X1]  120,24.5 90 top
J49  CON3X1  [CON3X1]  108,42.5 90 top
J50  5-1814832-1  [CON_SMA_TH_VERT]  107,24.5 180 top
J51  CON3X2  [CON3X2]  145,35.5 0 top
J52  CON_2X5  [CON_5X2]  165.5,52.5 270 top
J53  CON2X1  [CON2X1]  144,24.5 90 top
J54  CON3X1  [CON3X1]  140,42.5 90 top
J55  5-1814832-1  [CON_SMA_TH_VERT]  131,24.5 180 top
L1  10u  [SRR1260]  39.5,162.5 90 top
L2  221  [L0402_IPC7351_MED]  120.6,261.6 180 top
L3  221  [L0402_IPC7351_MED]  114.5,264.8 180 top
L4  221  [L0402_IPC7351_MED]  114.5,266.8 180 top
L5  221  [L0402_IPC7351_MED]  114.5,263.8 180 top
L6  33nH  [L0402_IPC7351_MED]  111.1,271.9 90 top
M1  RFM95W  [RFM95W]  43,9 180 top
M2  RFM95W  [RFM95W]  67,9 180 top
M3  RFM95W  [RFM95W]  91,9 180 top
M4  RFM95W  [RFM95W]  115,9 180 top
M5  RFM95W  [RFM95W]  139,9 180 top
PCB1  CTT-20190123  [BLANK_BRD]  -60,-110 0 top  (outside the outline)
Q1  BSS138K  [SOT-23]  101.3,198.9 270 top
Q2  BSS138K  [SOT-23]  82.5,149 270 top
Q3  BSS138K  [SOT-23]  88.5,149 270 top
Q4  BSS138K  [SOT-23]  29.1,217.9 270 top
Q5  BSS138K  [SOT-23]  29,214 270 top
Q6  FDV304P  [SOT-23]  35.5,78.5 270 top
Q7  BSS138K  [SOT-23]  35.5,72 270 top
Q8  BSS138K  [SOT-23]  19.5,101 270 top
Q9  BSS138K  [SOT-23]  13,101 270 top
R1  2.32k  [R0402_IPC7351_MED]  39.5,121 0 top
R2  1.00k  [R0402_IPC7351_MED]  42,121 0 top
R3  499  [R0402_IPC7351_MED]  20,198.5 0 top
R4  499  [R0402_IPC7351_MED]  20,196 0 top
R5  499k  [R0402_IPC7351_MED]  20.5,186.5 180 top
R6  499k  [R0402_IPC7351_MED]  20,153 270 top
R7  100k  [R0402_IPC7351_MED]  20,150.5 270 top
R8  100k  [R0402_IPC7351_MED]  20.5,184.5 0 top
R9  37.4k  [R0402_IPC7351_MED]  32.5,152.5 0 top
R10  1.91k  [R0402_IPC7351_MED]  30,151 180 top
R11  10.0k  [R0402_IPC7351_MED]  32.5,151 180 top
R12  499k  [R0402_IPC7351_MED]  11,197 180 top
R13  100k  [R0402_IPC7351_MED]  11,199.5 0 top
R14  1.00k  [R0402_IPC7351_MED]  20,170.5 0 top
R15  1.00k  [R0402_IPC7351_MED]  94,227.5 270 top
R16  100k  [R0402_IPC7351_MED]  48,227.5 270 top
R17  100k  [R0402_IPC7351_MED]  70,227.5 90 top
R18  100k  [R0402_IPC7351_MED]  49.5,227.5 270 top
R19  100k  [R0402_IPC7351_MED]  68.5,227.5 90 top
R20  2.00k  [R0402_IPC7351_MED]  27.5,236.5 0 top
R21  DNP  [R0402_IPC7351_MED]  113.5,191 90 top
R22  499  [R0402_IPC7351_MED]  88.5,269.5 90 top
R23  499  [R0402_IPC7351_MED]  154,217.5 270 top
R24  499  [R0402_IPC7351_MED]  164,217.5 270 top
R25  2.00k  [R0402_IPC7351_MED]  27.5,234 0 top
R26  DNP  [R0402_IPC7351_MED]  113.5,194 90 top
R27  100k  [R0402_IPC7351_MED]  57.5,182.5 180 top
R28  100k  [R0402_IPC7351_MED]  57.5,176.5 180 top
R29  4.99k  [R0402_IPC7351_MED]  66.5,197 270 top
R30  4.99k  [R0402_IPC7351_MED]  63,197 270 top
R31  4.99k  [R0402_IPC7351_MED]  63,200 90 top
R32  3.01k  [R0402_IPC7351_MED]  63,202.5 90 top
R33  4.99k  [R0402_IPC7351_MED]  66.5,200 90 top
R34  3.01k  [R0402_IPC7351_MED]  66.5,202.5 90 top
R35  100k  [R0402_IPC7351_MED]  111.5,268 180 top
R36  100k  [R0402_IPC7351_MED]  116.5,185 180 top
R37  1.00k  [R0402_IPC7351_MED]  129.5,248.5 180 top
R38  1.00k  [R0402_IPC7351_MED]  129.5,218.5 180 top
R39  1.00k  [R0402_IPC7351_MED]  138,233.5 180 top
R40  1.00k  [R0402_IPC7351_MED]  121.5,230.5 180 top
R41  10.0k  [R0402_IPC7351_MED]  129.5,246 0 top
R42  10.0k  [R0402_IPC7351_MED]  129.5,220 0 top
R43  10.0k  [R0402_IPC7351_MED]  138,231 0 top
R44  10.0k  [R0402_IPC7351_MED]  121.5,228.5 0 top
R45  49.9k  [R0402_IPC7351_MED]  99.9,196.4 0 top
R46  10.0k  [R0402_IPC7351_MED]  89.5,146 270 top
R47  100k  [R0402_IPC7351_MED]  30,210.5 90 top
R48  4.99k  [R0402_IPC7351_MED]  87.5,153.5 90 top
R49  100k  [R0402_IPC7351_MED]  33,225.5 90 top
R50  49.9k  [R0402_IPC7351_MED]  102.9,196.4 0 top
R51  10.0k  [R0402_IPC7351_MED]  112.3,155.7 180 top
R52  10.0k  [R0402_IPC7351_MED]  105.4,155.9 180 top
R53  100k  [R0402_IPC7351_MED]  108.3,158.1 0 top
R54  12.0k  [R0402_IPC7351_MED]  102.6,148.3 180 top
R55  100k  [R0402_IPC7351_MED]  108.3,159.4 0 top
R56  10.0k  [R0402_IPC7351_MED]  112.3,157 0 top
R57  10.0k  [R0402_IPC7351_MED]  123.2,147.2 270 top
R58  100k  [R0402_IPC7351_MED]  123.1,140.2 0 top
R59  100k  [R0402_IPC7351_MED]  120.8,143.5 90 top
R60  12.0k  [R0402_IPC7351_MED]  130.9,138 270 top
R61  100k  [R0402_IPC7351_MED]  119.5,143.5 90 top
R62  100k  [R0402_IPC7351_MED]  121.9,147.2 90 top
R63  10.0k  [R0402_IPC7351_MED]  68.4,101.2 90 top
R64  10.0k  [R0402_IPC7351_MED]  68.7,108 90 top
R65  100k  [R0402_IPC7351_MED]  70.7,105 270 top
R66  12.0k  [R0402_IPC7351_MED]  60.8,110.5 90 top
R67  100k  [R0402_IPC7351_MED]  72,105 270 top
R68  10.0k  [R0402_IPC7351_MED]  69.7,101.2 270 top
R69  10.0k  [R0402_IPC7351_MED]  116.8,97.1 180 top
R70  10.0k  [R0402_IPC7351_MED]  110.1,97.6 180 top
R71  100k  [R0402_IPC7351_MED]  113,99.6 0 top
R72  12.0k  [R0402_IPC7351_MED]  107,89.8 180 top
R73  100k  [R0402_IPC7351_MED]  113,100.9 0 top
R74  10.0k  [R0402_IPC7351_MED]  116.8,98.4 0 top
R75  1.00k  [R0402_IPC7351_MED]  22.5,110 0 top
R76  1.00k  [R0402_IPC7351_MED]  12.5,110 0 top
R77  1.00k  [R0402_IPC7351_MED]  9,110 0 top
R78  5.62k  [R0402_IPC7351_MED]  22.5,107.5 0 top
R79  5.62k  [R0402_IPC7351_MED]  12.5,107.5 0 top
R80  100k  [R0402_IPC7351_MED]  35.5,69 0 top
R81  1.00k  [R0402_IPC7351_MED]  19,110 0 top
R82  5.62k  [R0402_IPC7351_MED]  19,107.5 0 top
R83  5.62k  [R0402_IPC7351_MED]  9,107.5 0 top
R84  100k  [R0402_IPC7351_MED]  22.5,101 270 top
R85  100k  [R0402_IPC7351_MED]  35.5,75.5 0 top
R86  100k  [R0402_IPC7351_MED]  25,101 270 top
R87  100k  [R0402_IPC7351_MED]  16,101 270 top
R88  499  [R0402_IPC7351_MED]  9,101.5 270 top
R89  0  [R0402_IPC7351_MED]  18.5,61.5 90 top
R90  DNP  [R0402_IPC7351_MED]  16,61.5 270 top
R91  499  [R0402_IPC7351_MED]  29.5,44 90 top
R92  0  [R0402_IPC7351_MED]  14,38 0 top
R93  4.99k  [R0402_IPC7351_MED]  45,25 90 top
R94  0  [R0402_IPC7351_MED]  50.5,61.5 90 top
R95  DNP  [R0402_IPC7351_MED]  48,61.5 270 top
R96  499  [R0402_IPC7351_MED]  61.5,44 90 top
R97  0  [R0402_IPC7351_MED]  46,38 0 top
R98  4.99k  [R0402_IPC7351_MED]  69,25 90 top
R99  0  [R0402_IPC7351_MED]  82.5,61.5 90 top
R100  DNP  [R0402_IPC7351_MED]  80,61.5 270 top
R101  499  [R0402_IPC7351_MED]  93.5,44 90 top
R102  0  [R0402_IPC7351_MED]  78,38 0 top
R103  4.99k  [R0402_IPC7351_MED]  93,25 90 top
R104  0  [R0402_IPC7351_MED]  114.5,61.5 90 top
R105  DNP  [R0402_IPC7351_MED]  112,61.5 270 top
R106  499  [R0402_IPC7351_MED]  125.5,44 90 top
R107  0  [R0402_IPC7351_MED]  110,38 0 top
R108  4.99k  [R0402_IPC7351_MED]  117,25 90 top
R109  0  [R0402_IPC7351_MED]  146.5,61.5 90 top
R110  DNP  [R0402_IPC7351_MED]  144,61.5 270 top
R111  499  [R0402_IPC7351_MED]  157.5,44 90 top
R112  0  [R0402_IPC7351_MED]  142,38 0 top
R113  4.99k  [R0402_IPC7351_MED]  141,25 90 top
R114  499  [R0402_IPC7351_MED]  24,214.5 90 top
S1  CW_GF-126-0159  [CW_GF-126-0159]  8,182 0 top
SW1  EVQ-P0N02B  [EVQP0]  137.5,250.5 0 top
SW2  EVQ-P0N02B  [EVQP0]  137.5,220.5 0 top
SW3  EVQ-P0N02B  [EVQP0]  145.5,235.5 0 top
SW4  EVQ-P0N02B  [EVQP0]  129.5,235.5 0 top
T1  NTCLG100E2104JT  [DO35-VERT]  57.5,179.5 0 top
TP1  SMD_PAD2X2  [SMD_PAD]  17,179 0 top
TP2  SMD_PAD2X2  [SMD_PAD]  27,174 0 top
TP3  SMD_PAD2X2  [SMD_PAD]  27,193.5 0 top
TP4  SMD_PAD2X2  [SMD_PAD]  27,205.5 0 top
TP5  SMD_PAD2X2  [SMD_PAD]  35.7,110 0 top
U1  NCP1117DT33G  [DPAK]  38,185.5 180 top
U2  TPS73801  [TI_R-PDSO-G6]  38.5,128.5 0 top
U3  NCP1117ST18T3G  [SOT-223]  36.5,198.5 270 top
U4  TPS54531  [TI_R-PDSO-G8]  27,154.5 270 top
U5  RPI_CM3  [1473149-4]  72,220.5 90 top
U6  CAM-M8Q  [LCC31]  121,270 90 top
U7  TLC1543IDW  [SOIC20_DW0020A]  67.5,188 0 top
U8  4259-63  [SC-70_PEREGRINE]  114.2,272.8 180 top
U9  DS3231SN#  [SO16-WIDE_MAXIM]  121,193 180 top
U10  FSUSB42MSOP  [MSOP-10]  94.9,199.4 90 top
U11  USB2514B/M2  [SQFN-36]  107.9,151.5 90 top
U12  USB2514B/M2  [SQFN-36]  127.5,143 180 top
U13  USB2514B/M2  [SQFN-36]  64,105.5 0 top
U14  USB2514B/M2  [SQFN-36]  112.5,93 90 top
U15  SIM800C  [SIM800C]  19.5,84.5 0 top
U16  FULLM2M_QUAD  [MFF2]  15.5,69 0 top
U17  ATMEGA32U4-AU  [TQFP44]  24,53.5 270 top
U18  ATMEGA32U4-AU  [TQFP44]  56,53.5 270 top
U19  ATMEGA32U4-AU  [TQFP44]  88,53.5 270 top
U20  ATMEGA32U4-AU  [TQFP44]  120,53.5 270 top
U21  ATMEGA32U4-AU  [TQFP44]  152,53.5 270 top
U$1  [HEX_8MM]  35,24.5 0 top
U$2  [CTT-LOGO_W2INCH]  88,115.4 0 top
U$138  [FIDUCIAL]  4,253.5 0 top
U$140  [FIDUCIAL]  4,23.5 0 top
U$240  [FUNCUBE_ENVELOPE_VERT]  152,123.5 0 top
U$241  [FUNCUBE_ENVELOPE_VERT]  152,93.5 0 top
U$242  [FUNCUBE_ENVELOPE_VERT]  152.5,153.5 0 top
U$243  [FUNCUBE_ENVELOPE_VERT]  152.5,183.5 0 top
U$244  [FUNCUBE_ENVELOPE_VERT]  52.5,81 90 top
U$245  [FUNCUBE_ENVELOPE_VERT]  78,81 90 top
U$246  [PI_HAT_OUTLINE]  69.5,257 0 top
U$247  [FIDUCIAL]  172,23.5 0 top
U$248  [FIDUCIAL]  172,253.5 0 top
U$249  [BORDER_C_DOCU]  -62,-111.5 0 top  (outside the outline)
Y1  ABM3B-24.000MHZ  [ABM3B]  96.4,149.1 180 top
Y2  ABM3B-24.000MHZ  [ABM3B]  130,132 270 top
Y3  ABM3B-24.000MHZ  [ABM3B]  61.8,116 90 top
Y4  ABM3B-24.000MHZ  [ABM3B]  100.7,90.8 180 top
Y5  ABM3B-8.000MHZB2T  [ABM3B]  12.5,55.5 90 top
Y6  ABM3B-8.000MHZB2T  [ABM3B]  44.5,55.5 90 top
Y7  ABM3B-8.000MHZB2T  [ABM3B]  76.5,55.5 90 top
Y8  ABM3B-8.000MHZB2T  [ABM3B]  108.5,55.5 90 top
Y9  ABM3B-8.000MHZB2T  [ABM3B]  140.5,55.5 90 top

## Tracks (layer width: path | path; a pad name or v marks a point on that pad's centre or on a via)
#PB1  (via drill 0.3 pad 0.61)
  Top 0.305: U5.15 44.55,217.85 44.4,218 v44.4,219.5 | v44.5,242.9 v53,242.9 122.5,242.9 127,247.4 127,248.45 C35.P$2 R37.P$2
  Bottom 0.305: J16.7 v53,242.9 | v44.4,219.5 44.4,242.8 v44.5,242.9
#PB2  (via drill 0.3 pad 0.61)
  Top 0.305: U5.17 45.15,217.85 45.2,217.9 v45.2,218.5 | v45.2,242.1 v80.9,242.1 v126.8,242.1 | R38.P$2 C36.P$2 126.9,218.55 126.9,219.4 126.8,219.5 v126.8,221.1
  Bottom 0.305: v45.2,218.5 v45.2,242.1 | J16.29 80.9,255.7 v80.9,242.1 | v126.8,242.1 v126.8,221.1
#PB3  (via drill 0.3 pad 0.61)
  Top 0.305: U5.21 46.35,217.85 46.2,218 v46.2,219.5 | v46.1,241.3 v83.4,241.3 134.4,241.3 137.55,238.15 C37.P$2 R39.P$2
  Bottom 0.305: v46.2,219.5 v46.1,241.3 | J16.31 83.5,255.7 v83.4,241.3
#PB4  (via drill 0.3 pad 0.61)
  Top 0.305: U5.23 46.95,217.85 47,217.9 v47,218.5 | v47.1,240.5 v74.6,240.5 110.2,240.5 118.95,231.75 C38.P$2 R40.P$2
  Bottom 0.305: v47,218.5 47,230.7 47.1,230.8 v47.1,240.5 | J16.26 74.6,257.02 v74.6,240.5
ADC_#CS  (via drill 0.3 pad 0.61)
  Top 0.305: U5.65 63.15,214.85 63.3,214.7 v63.3,214 | v63.3,207.6 v65.9,207.6 | v68.1,194.5 68.1,192.69 U7.15
  Bottom 0.305: v63.3,214 v63.3,207.6 | v65.9,207.6 65.9,196.7 v68.1,194.5
ADC_ADDR  (via drill 0.3 pad 0.61)
  Top 0.305: U5.71 64.95,214.85 65.1,214.7 v65.1,214 | U7.17 v65.59,194.5 v65.6,194.5
  Bottom 0.305: v65.1,214 65.1,195 v65.6,194.5
ADC_DOUT  (via drill 0.3 pad 0.61)
  Top 0.305: U5.69 64.35,214.85 64.3,214.8 v64.3,213 | R29.P$1 R33.P$1 66.45,199.6 v64.3,199.6
  Bottom 0.305: v64.3,213 v64.3,199.6
ADC_EOC  (via drill 0.3 pad 0.61)
  Top 0.305: U5.57 60.75,214.85 60.8,214.8 v60.8,214 | R30.P$1 R31.P$1 62.95,199.6 v60.8,199.6
  Bottom 0.305: v60.8,214 v60.8,199.6
ADC_IOCLK  (via drill 0.3 pad 0.61)
  Top 0.305: U5.63 62.55,214.85 62.5,214.8 v62.5,213 | v64.3,194.5 64.3,192.68 U7.18
  Bottom 0.305: v62.5,213 62.5,196.3 v64.3,194.5
AUX1_#CS  (via drill 0.3 pad 0.61)
  Top 0.305: U5.72 65.25,225.95 65.3,226 v65.3,228 | v65.3,239.7 38.2,239.7 35.7,241.7 J14.6
  Bottom 0.305: v65.3,228 v65.3,239.7
AUX2_#CS  (via drill 0.3 pad 0.61)
  Top 0.305: U5.76 66.45,225.95 66.4,226 66.4,228.1 65.7,228.8 60.3,228.8 59.2,229.9 44.5,229.9 42.5,227.9 v35,227.9 | v35.1,240.4 15.3,240.4 J15.6
  Bottom 0.305: v35,227.9 35.1,228 v35.1,240.4
AUX3_#CS  (via drill 0.3 pad 0.61)
  Top 0.305: U5.78 67.05,226.25 67,226.3 67,228.4 65.9,229.5 60.7,229.5 59.7,230.5 44.1,230.5 42.3,228.7 v36,228.7 | J18.6 6.5,243.2 23.8,243.2 24.5,242.5 v36,242.5
  Bottom 0.305: v36,228.7 v36,242.5
CH1_#RESET  (via drill 0.3 pad 0.61)
  Top 0.305: U5.45 57.15,214.95 57.1,214.9 v57.1,214 | v50.2,129.6 v44.6,129.6 | v19.6,62 18.55,62 R89.P$2
  Bottom 0.305: v57.1,214 57.1,195.4 50.2,188.5 v50.2,129.6 | v19.6,62 36,78.4 36,109.9 44.6,118.5 v44.6,129.6
CH2_#RESET  (via drill 0.3 pad 0.61)
  Top 0.305: U5.52 59.25,222.65 57.7,221.1 v57,221.1 | v50.5,63.3 R94.P$2
  Bottom 0.305: v57,221.1 57,217.6 56.2,216.8 56.2,195.6 49.4,188.8 49.4,64.4 v50.5,63.3
CH3_#RESET  (via drill 0.3 pad 0.61)
  Top 0.305: U5.54 59.85,222.65 v60.5,222 | v82.5,63.7 R99.P$2
  Bottom 0.254: 59,117.4 59,112 74.7,96.3 74.7,71.5 v82.5,63.7
  Bottom 0.305: v60.5,222 60.5,217.8 59.7,217 59.7,180.9 59,180.2 59,117.4
CH4_#RESET  (via drill 0.3 pad 0.61)
  Top 0.305: U5.58 61.05,222.75 v62.1,221.7 | v114.5,63.2 R104.P$2
  Bottom 0.305: v62.1,221.7 62.1,214 61.7,213.6 61.7,178.3 60.2,176.8 60.2,127.5 76,111.7 76,101.7 v114.5,63.2
CH5_#RESET  (via drill 0.3 pad 0.61)
  Top 0.305: U5.60 61.65,223.25 62.2,222.7 v62.9,222.7 | v65.9,208.6 v69.8,208.6 | v146.5,63.2 R109.P$2
  Bottom 0.305: v62.9,222.7 62.9,218 65.9,215 v65.9,208.6 | v146.5,63.2 141.5,68.2 141.5,99.5 76.7,164.3 76.7,193.8 69.8,200.7 v69.8,208.6
CM3_USB_D_N
  Top 0.254: U10.4 96.13,199.9 95.64,200.39
  Top 0.305: 95.64,200.39 95.67,200.42
  Top 0.381: 95.67,200.42 95.2,200.88 95.2,201.68 93.75,203.13 93.75,211.85 arc-90 94,212.1 arc90 94.2,212.3 94.2,212.7 arc90 94,212.9 arc-90 93.75,213.15 93.75,213.45 arc-90 94,213.7 arc90 94.2,214 94.2,214.2 arc90 94,214.5 arc-90 93.75,214.75 U5.167
CM3_USB_D_P
  Top 0.254: U10.3 95.87,199.4 95.26,200.01
  Top 0.305: 95.26,200.01 95.21,200.01 95.11,200.11
  Top 0.381: 95.23,199.98 95.11,200.11 94.59,200.62 94.59,201.42 93.15,202.87 U5.165
DC_1V8  (via drill 0.3 pad 0.61)
  Top 0.305: v30,198.5 30,202.5 TP4.1 v28.7,205.5 | R47.P$1 v30,209.2
  Top 0.61: U3.2 U3.4
  Bottom 0.305: v30,209.2 30,206.8 v28.7,205.5
  other vias: 102.5,209.5 102.5,205 103.5,207 29,198.5 31,198.5
  pour Route3 (isolate 0.254, rank 2): 104.5,210.5 104.5,197.5 28.5,197.5 28.5,201.5 101,201.5 101,210.5
  pour Top (isolate 0.254, rank 4): 99.5,227 99.5,221.2 99.2,220.9 99.2,215 101.8,215 101.8,212.5 104.5,212.5 104.5,204 101,204 101,210 98.5,210 98.4,221.9 98.7,222.2 98.8,227
  pour Top (isolate 0.254, rank 4): 26.5,197 34,197 34,199 26.5,199
DC_3V3  (via drill 0.3, 0.3 pad 0.61)
  Top 0.203: U13.27 68.62,107.5 R64.P$1 | v67.4,100.8 68.38,100.8 R63.P$1 R68.P$2 | U12.27 v123.1,141
  Top 0.254: U14.10 116,91 116.2,90.8 | U14.29 109,94.5 108.8,94.7 | U14.27 110.5,97.6 R70.P$1 110.53,98.6 v110.5,98.6 | U14.5 v112.5,88.2 | U14.36 109.3,91 108.9,90.6 | U14.23 112.5,97.53 C96.P$2 | U14.15 116.1,93.5 116.4,93.8 | U13.36 62,108.5 61.4,108.5 | U13.23 68.62,105.5 C83.P$2 | R64.P$1 69.88,107.58 v69.9,107.6 | U13.29 65.5,109 65.88,109.38 C84.P$2 | v59.3,105.5 U13.5 | U13.10 62,102.1 61.9,101.9 | U13.15 64.5,101.9 64.9,101.4 C81.P$2 | v117.2,96.1 117.22,96.12 R69.P$1 R74.P$2 | U12.36 129.5,140 130.1,140 | U12.29 126,139.57 C68.P$2 | U12.5 v132.3,143 | U12.15 127,146.5 126.7,146.9 | U12.10 129.5,146.6 129.7,146.9 | U12.23 122.88,143 C65.P$2 121.83,143.07 v121.8,143.1 | U11.36 104.8,149.5 104.8,149.1 104.5,148.8 | U11.5 v107.9,146.9 | U11.15 111.9,152 112.2,152.3 C48.P$2 | R57.P$1 124.17,147.62 v124.3,147.7 | v112.7,154.7 112.72,154.72 R51.P$1 R56.P$2 | U11.23 107.9,156.12 C50.P$2 | U11.27 105.9,155.88 R52.P$1 105.83,156.47 v105.7,156.9 | U11.29 104.38,153 C51.P$2 | L6.P$1 111.1,270.12 C32.P$2 111.08,269.12 v111.1,269.1 | v114.8,269.1 114.83,269.12 C31.P$1 114.85,270.12 U8.6 | R48.P$2 v87.5,154.8 | D8.A 24,219.5 v24.3,220 | U11.10 111.3,149.5 111.5,149.3 C49.P$2
  Top 0.305: U17.6 v24,61.1 C111.P$2 | U21.6 v152,61.5 C147.P$2 | U20.6 v120,61.5 C138.P$2 | U19.6 v88,61 C129.P$2 | U18.6 v56,61.1 C120.P$2 | R90.P$1 v16,63 | C113.P$1 v16,56 16.1,55.9 U17.14 | v33.5,57.5 33.45,57.45 C109.P$2 32.45,57.5 U17.44 | U17.34 31.2,49.5 31.65,49.05 C114.P$1 33.45,49.05 v33.5,49.1 | U17.33 v29,47.7 | U17.24 20.8,46.3 20.4,45.9 20.4,45.05 C110.P$2 20.45,44.05 v20.4,44 | R95.P$1 v48,63 | C122.P$1 v48,56 48.7,56 48.8,55.9 U18.14 | U18.44 64.45,57.5 C118.P$2 65.55,57.45 v65.6,57.5 | U18.34 63.2,49.5 63.65,49.05 C123.P$1 65.45,49.05 v65.5,49.1 | U18.33 v61,47.7 | U18.24 52.8,46.2 52.5,45.9 52.5,45.05 C119.P$2 52.45,44.05 v52.5,44 | C131.P$1 v80,56.5 80.6,55.9 U19.14 | v80,63 R100.P$1 | U19.44 96.45,57.5 C127.P$2 97.55,57.45 v97.6,57.5 | U19.34 95.2,49.5 95.65,49.05 C132.P$1 97.55,49.05 v97.6,49.1 | U19.33 v93.1,47.7 | U19.24 84.8,46.1 84.5,45.8 84.5,45.05 C128.P$2 84.45,44.05 v84.4,44 | v112,63 R105.P$1 | C140.P$1 v112,56.5 112.6,55.9 U20.14 | U20.44 128.45,57.5 C136.P$2 129.45,57.45 v129.5,57.5 | U20.34 127,49.5 127.45,49.05 C141.P$1 129.45,49.05 v129.5,49.1 | U20.33 v125,47.7 | U20.24 116.8,46.2 116.9,46.1 116.9,45.05 C137.P$2 116.95,44.05 v116.9,44 | C149.P$1 v144,56.4 144.5,55.9 U21.14 | U21.44 160.45,57.5 C145.P$2 161.55,57.45 v161.6,57.5 | U21.34 159,49.5 159.4,49.1 160.45,49.1 C150.P$1 161.45,49.05 v161.5,49.1 | U21.33 v157.1,47.7 | U21.24 148.8,46.1 148.9,46 148.9,45.05 C146.P$2 148.95,44.05 v148.9,44 | R112.P$1 v140.3,38 | R107.P$1 v108.2,38 | R102.P$1 v76.2,38 | R97.P$1 v44.3,38 | R92.P$1 v12.3,38 | v29.2,236.5 R20.P$2 R25.P$2 | R42.P$1 v128,220 | R43.P$1 v136.5,231 | R44.P$1 v120,228.5
  Top 0.305: v128,246 R41.P$1 | R3.P$2 R4.P$2 21.8,196 24.3,193.5 TP3.1 | R21.P$2 v113.5,192.5 | R26.P$2 v113.5,198.3 | U9.2 124.17,199.12 124,199.3 124,199.95 C34.P$1 123.95,201.05 v123.9,201.1 | R110.P$1 v144,63.1 | 116.2,90.8 C95.P$2 117.08,89.92 v117.1,89.8 | 108.8,94.7 108.72,94.78 C97.P$2 107.53,94.78 v107.1,95.2 107.08,95.2 | v112.5,88.2 C93.P$2 | 108.1,88.8 C99.P$2 107.4,88.8 107.4,88.2 107.03,87.83 106.62,87.83 v106.6,87.8 | C96.P$2 112.58,98.58 v112.6,98.6 | 116.4,93.8 C94.P$2 117.08,94.9 C98.P$2 117.17,96.08 v117.2,96.1 | 59.8,109.4 C86.P$2 59.73,110.08 59.8,110.1 59.1,110.1 58.8,110.4 v58.8,110.8 | C83.P$2 69.67,105.42 v69.7,105.4 | C84.P$2 65.88,110.47 v66.3,110.9 | v59.3,105.5 C80.P$2 | 61.9,101.9 C82.P$2 60.92,100.92 v60.9,100.9 | C81.P$2 66.2,100.92 C85.P$2 67.38,100.83 v67.4,100.8 | v133.1,137.6 132.78,138.43 C71.P$2 132.1,139.1 | C68.P$2 125.22,138.32 v124.7,137.8 | v132.3,143 C64.P$2 | v124.3,147.7 C70.P$2 C67.P$2 126.7,146.9 | 129.7,146.9 C66.P$2 130.38,147.68 130.7,148 v130.7,148.5 | 103.7,147.3 C53.P$2 103.03,146.82 102.8,146.6 102.5,146.6 v102.2,146.3 | C47.P$2 v107.9,146.9 | C48.P$2 C52.P$2 112.7,153.6 112.7,154.6 112.67,154.62 v112.7,154.7 | C51.P$2 103.12,153.68 103,153.8 103,154.2 v102.7,154.5 | 107.9,156.12 v107.9,157.1 | U10.1 97.08,198.38 C39.P$1 97.08,196.43 v97.8,195.7 | R45.P$1 99.47,195.53 v99.5,195.4 | C49.P$2 112.67,148.32 v112.7,148.3
  Top 0.406: J7.1 59.3,171 62.5,167.8 J9.1 60.7,165 55.9,169.8 55.9,177.9 T1.P$1 | 108.9,90.6 108.9,89.6 108.1,88.8 | 61.4,108.5 60.7,108.5 59.8,109.4 | 130.1,140 131,139.1 132.1,139.1 | 104.5,148.8 104.5,148.1 103.7,147.3 | v128.3,6.2 v128.3,6.9 128.3,7.97 C151.P$2 M5.13 | v104.3,6.2 v104.3,6.9 104.33,6.93 C142.P$2 M4.13 | v80.3,6.2 v80.3,6.9 80.33,6.93 C133.P$2 M3.13 | v56.3,6.2 v56.3,6.9 56.33,6.93 C124.P$2 M2.13 | v32.3,6.2 v32.3,6.9 32.33,6.93 C115.P$2 M1.13
  Bottom 0.305: v128,220 136.5,228.5 v136.5,231 | v113.5,192.5 v113.5,198.3
  other vias: 1,164.5 35.5,192.5 35.5,193.5 35.5,190.5 35.5,191.5 111,216 110,209.5 111,212 101.3,222.3 52.8,224.6 55.5,224.6 53.8,216.4 53.8,218.4 127.9,268.9 127,268.9 127.9,267.6
  pour Route3 (isolate 0.305, rank 3): 0,0 0,162 29,162 29,156 42.5,156 42.5,159.5 41,159.5 40,160.5 34,160.5 32,162.5 32,163.5 0,163.5 0,277 117.3,277 117.3,272 124.7,272 124.7,277 176,277 176,195 55,195 55,183 35.5,183 35.5,186 19,186 19,166 136.5,166 136.5,136.5 97.5,136.5 97.5,144.5 83.5,144.5 83.5,130.5 32,130.5 32,121.5 68,121.5 68,112.5 121,112.5 121,85 99,85 99,99 49,99 49,107.5 32,107.5 32,92.5 24,92.5 24,87 32,87 32,70 176,70 176,0
  pour Route3 (isolate 0.254): 0,165 29,165 29,160.5 0,160.5
  pour Top (isolate 0.254, rank 2): 33.5,185 33.5,190.5 26.5,190.5 26.5,196.5 36,196.5 36,194.5 37.5,194.5 37.5,190 42.5,190 42.5,185
  pour Top (isolate 0.254, rank 3): 101.9,227 101.9,219.3 101.6,219 101.6,215.5 107.2,215.5 108.7,217 112,217 112,209 109.5,209 109.5,212.5 101.7,212.5 100.3,213.9 100.3,219.9 100.6,220.2 100.6,227
  pour Top (isolate 0.254): 52,225.1 52,218.3 51.7,218 51.7,215.8 56,215.8 56,222.9 56.3,223.2 56.3,225.1
  pour Top (isolate 0.254): 124.9,271.9 124.9,268.6 126.6,268.6 126.6,266 124.9,266 124.9,263.7 128.2,263.7 128.2,271.9
DC_4V
  Top 0.254: 37.2,121 C3.P$2
  Top 0.61: U2.2 37.23,121.03 37.2,121
  Top 1.016: C4.+ TP5.1 35.7,108.1 31,103.4 31,97.4 29.46,95.86 C5.2
  pour Top (isolate 0.254): 35.5,115.5 35.5,122.5 37,122.5 37,123.9 37.5,123.9 37.5,122.5 39,122.5 39,115.5
  pour Top (isolate 0.254): 22.3,96.3 22.3,93.2 25.2,93.2 25.2,94.3 28.4,94.3 28.4,96.3
DC_5V  (via drill 0.3 pad 0.61)
  Top 0.254: R46.P$2 89.5,137 88.5,136 J21.1
  Top 0.305: R85.P$1 35.05,77.05 35.5,77.5 35.5,78.5 36.44,79.44 Q6.2 36.56,79.4 37.6,79.4 38.1,78.9 v38.1,77.5 | U17.7 23.2,60.3 22.5,61 C108.P$1 21.45,61.55 v21.4,61.6 | U21.7 151.2,60.6 150.5,61.3 C144.P$1 149.55,62.05 v149.5,62 | U20.7 119.2,60.5 118.5,61.2 C135.P$1 117.55,62.05 v117.5,62 | U19.7 87.2,60.2 86.5,60.9 C126.P$1 85.45,61.55 v85.4,61.5 | U18.7 55.2,60.2 54.5,60.9 C117.P$1 53.45,61.55 v53.4,61.5 | C56.P$1 149,178.05 149,179.1 | C62.P$1 149,148.05 149,149 | C63.P$1 148.5,127.95 148.5,127.1 | C69.P$1 148.5,97.95 148.5,96.9 | 49.1,77.5 48.05,77.5 C79.P$1 47.95,77.45 47.9,77.5 v46,77.5 | C78.P$1 73.55,77.5 74.5,77.5 | U7.20 60.1,192.65 C30.P$2 58.95,192.55 v58.9,192.6 | U7.14 69.41,192.4 v69.4,190.7 | C17.P$2 R11.P$1 v34,151 | R14.P$2 21.9,170.5 v21.9,170 | D9.A 9,105.3 v27.1,105.4 | C54.P$1 83.3,134.5
  Top 0.61: U2.1 v34.8,125.4 v33.9,125.4 | U2.5 v42.2,125.4 v43.1,125.4 | 83.3,134.5 J21.1
  Top 0.813: 49.1,77.5 J27.1 | 74.5,77.5 J26.1 | 148.5,96.9 J25.1 | 148.5,127.1 J24.1 | 149,149 J23.1 | 149,179.1 J22.1
  Bottom 0.305: v34,151 34,167.7 v31.7,170 | v46,77.5 v38.1,77.5 | v27.1,105.4 27.1,118.6 v33.9,125.4
  Bottom 1.016: J14.1 23,187 26.6,183.4 v26.6,180.4 v26.6,178.3 | J18.1 J15.1 J14.1 | J14.1 25.1,226.5 30.8,232.2 30.8,239.4 36.4,245 36.4,259 38.8,261.4 45.3,261.4 | 45.3,261.4 47.9,261.4 J16.4 | J16.2 45.37,261.33 45.3,261.4
  other vias: 111.5,225 110,223 110,218.5 111.5,220.5 24.3,170 26.8,170 29.3,170 26.6,179.7 26.6,179
  pour Route3 (isolate 0.305): 109,227 176,227 176,71 150.5,71 150.5,61.5 148,61.5 148,71 118.5,71 118.5,61.5 116,61.5 116,71 86.5,71 86.5,61 84,61 84,71 54.5,71 54.5,61 52,61 52,71 30,71 23,64 23,61 20.5,61 20.5,66 33,78.5 33,87 34.5,87 34.5,92.5 33,92.5 33,106.5 48,106.5 48,98 98,98 98,84 122,84 122,113.5 69,113.5 69,122.5 33,122.5 33,129.5 84.5,129.5 84.5,143.5 96.5,143.5 96.5,135.5 137.5,135.5 137.5,167 20,167 20,185 34.5,185 34.5,182 56,182 56,194 126.5,194 126.5,217 109,217
  pour Top (isolate 0.254): 21.5,168.5 34.5,168.5 34.5,167 44.5,167 44.5,174.5 34,174.5 34,184.5 26,184.5 26,179.5 21.5,179.5
  pour Top (isolate 0.254): 103,227 103,218.4 102.7,218.1 102.7,214.5 105.5,214.5 108.5,217.5 112,217.5 112,227
EMMC_DISABLE_N
  Top 0.254: U5.2 38.4,224.6 37.6,223.8 28.6,223.8 28.08,223.28 Q4.3
EMMC_EN_N_1V8  (via drill 0.3 pad 0.61)
  Top 0.305: U5.90 70.65,223.25 v69.6,222.2 | v69.6,213 67.5,210.9 47.9,210.9 v45.8,213 | v37.5,213 31.3,213 31.24,213.06 Q5.1 30.02,210.94 R47.P$2
  Bottom 0.305: v69.6,222.2 v69.6,213 | v45.8,213 v37.5,213
GND  (via drill 0.3 pad 0.61)
  Top 0.254: U14.11 v114,91.5 U14.C | U11.11 v109.4,150 | U11.C v106.4,150 | U13.11 v62.5,104 U13.C
  Top 0.305: C56.P$2 v146.8,178 | C62.P$2 v146.9,148 | C63.P$2 v146.4,128 | C69.P$2 v146.5,98 | C79.P$2 v48,75.6 | C78.P$2 v73.5,75.5 | C93.P$1 v112.5,85.1 | C64.P$1 v134.7,143 | U12.11 v129,144.5 | C47.P$1 v107.9,144.5 | U8.2 v114.2,275 | U10.10 v92.7,197.6 | J20.5 82.6,194.7 v81.9,194 | v126,141.5 U12.C
  Top 0.381: C80.P$1 v56.8,105.5
  other vias: 38.5,123.4 40,116 44.6,116 32.5,86.6 32.5,92.3 29.2,87.9 29.2,91 25.7,91 25.7,88 20.6,91.6 22.5,98 24,98 25.5,98 23.8,77.5 21.7,77.5 15.1,77.5 13.3,82.9 8.3,68.5 22.6,71 22.5,69.5 22.5,68 11.6,70.9 17.4,73 99.9,220.6 102.3,218.7 37.8,73 37.7,76.3 25.7,77.5 23.4,80.6 9.7,81.2 11,91.8 29.7,94.3 48.4,111.9 11.1,67.1 18.1,65.7 24.8,57.6 56.8,57.7 88.8,57.7 120.8,57.6 152.8,57.7 160.5,55.4 161.6,50.2 148.8,49.5 155.9,49.7 129.6,56.4 129.6,50.2 117,49.4 123.7,49.4 97.6,56.4 97.6,50.2 83.9,49.4 92,49.4 65.6,56.4 65.6,50.2 53.5,49.4 59.8,49.4 33.6,56.4 33.6,50.2 19.9,49.4 16.8,48.2 26.7,44.6 54.5,9.1 34.8,38.9 51.7,226.5 56.7,226.5 61.5,226.6 32.9,222.8 63.9,219.5 61.7,230.3 67.9,230.3 64.9,222.7 73.1,222.7 77.4,222.7 81.7,222.7 86.1,222.7 90.5,222.7 95,222.7 94.6,218.5 88.5,218.5 84,218.5 79.7,218.5 75.4,218.5 39.1,223.8 44.9,214.4 41.5,214.5 58.8,214 71,211.5 71.3,214 77.6,214 82.2,214 86.5,214 90,210.9 89.6,204.7 97.3,204.7 97.1,201.2 130.1,270 130.1,266.5 123.8,267.8 123.8,266.8 118.2,271.7 118.2,270.8 118.2,268.8 118.2,267.8 119,264.9 123,264.9 115.1,276.1 126.9,276.1 126.9,274.8 126.9,273.8 116,223.7 116,222.3 116,219.3 116,217.9 116,214.8 116,213.2 116,210.3 116,208.8 108.4,210.3 108.4,208.8 108.4,205.8 108.4,204.3 105.3,201.5 112.1,194.6 114.8,192.5 117.8,195.6 120.4,195.6 120.4,186.2 124.2,186.4 124.2,183.9 120.4,183.9 91.5,184.6 97.9,184.6 97.9,160.7 98.2,177.3 91.1,177.5 113.8,155 103.7,155.6 108.8,160.5 118.2,144.3 114.3,148.3 150.2,151.2 138.9,144.6 140.4,135.2 98.5,144.7 106.5,115.3 102.5,100.5 105.4,90.8 118.3,89.7 119.1,93.7 47.4,132.4 51.5,132.4 50.7,111.9 48.5,105.5 74.6,103.2 73.4,95.9 27.5,202.4 33.3,202.4 30.8,189.4 28.3,187.8 41.2,192 22.8,183 30.5,164.8 28,164.8 25.5,164.8 23,164.8 25.9,162.6 25.9,160.3 25.9,161.5 16,158.7 18,158.7 20,157 31.8,155.1 32,121 43.6,121 19.4,191 21.8,150.1 135.5,153.2 132.9,151.1 141.5,158.2 103.4,140 122.4,144.9 112.8,141.6 106.7,128.1 86.4,116.6 70,110.4 73.3,104.6 140.4,99.1 108.6,108.6 141.9,100.8 116.7,82.7 110.8,79.1 99.8,79.4 97.1,79.3 102.5,85.4 92.9,83.6 104.1,72.4 119.4,67.9 127.6,80.5 125.7,74.6 142.3,74.5 142.3,80.4 150.4,64.1 157.1,69.9 118.5,64.2 125.1,64.2 86.5,63.7 94.3,62.5 54.5,63.7 63.5,65.5 80.4,145.5 93,133.9 80.7,116.5 55.9,91.7 61.8,91.4 77.4,103.2 62.6,71.4 43.4,67.7 33.7,66.5 22.6,63.8 144.7,139.3 158,145.1 155.6,130.8 140.6,115.3 134.3,114.7 115,262.5 115,265.8 145,276 155,276 153.5,265.5 135,276 91,276 81,276 71,276 61,276 51,276 41,276 21,276 31,276 159,258 168,256.5 175,256.5 175,246.5 175,236.5 175,226.5 175,216.5 175,206.5 175,196.5 175,176.5 175,166.5 175,156.5 175,146.5 175,136.5 175,126.5 175,116.5 175,106.5 175,96.5 175,86.5 175,76.5 175,66.5 175,56.5 175,46.5 175,36.5 175,26.5 1,256.5 1,246.5 1,226.5 1,176.5 1,166.5 1,156.5 1,146.5 1,136.5 1,126.5 1,116.5 1,106.5 1,96.5 1,86.5 1,76.5 1,66.5 1,56.5 1,46.5 1,36.5 1,26.5 143.6,40.7 140.2,36.3 111,91.5 111,94.5 114,94.5 126,144.5 129,141.5 62.5,107 65.5,107 65.5,104 109.4,153 106.4,153 21.5,1.5 112.2,271.2 123.5,139.1 113.8,269.1 38.4,213.9 41.2,212 19.4,187.6 16.6,199.4 37.6,14 61.6,14 85.6,14 109.6,14 133.6,14 30.6,9.1 78.6,9.1 102.6,9.1 126.5,9.1 149.3,2 149.3,16.1 80.3,134.5 101.3,137.9 113,129.6 112.8,126.9 127.3,115.3 125.6,113.8 49,209.9 39.1,227.1 74.7,239.2 55.4,235.4 96.8,212.6 84.7,105.7 73.4,71.4 74.3,270.1
  pour Route2 (isolate 0.254): 0,277 117.3,277 117.3,272 124.7,272 124.7,277 176,277 176,0 133.5,0 133.5,27 128.5,27 128.5,0 109.5,0 109.5,27 104.5,27 104.5,0 85.5,0 85.5,27 80.5,27 80.5,0 61.5,0 61.5,27 56.5,27 56.5,0 37.5,0 37.5,27 32.5,27 32.5,0 0,0 0,162 29,162 29,156 42.5,156 42.5,159.5 41,159.5 40,160.5 34,160.5 32,162.5 32,163.5 0,163.5
  pour Route2 (isolate 0.254): 29,165 29,154.5 0,154.5 0,165